# EAGLE design Blitz_Luftdruck_V10 (EAGLE 6.5.0)
Assembly variants: Variante1

## Sheet 1 of 5
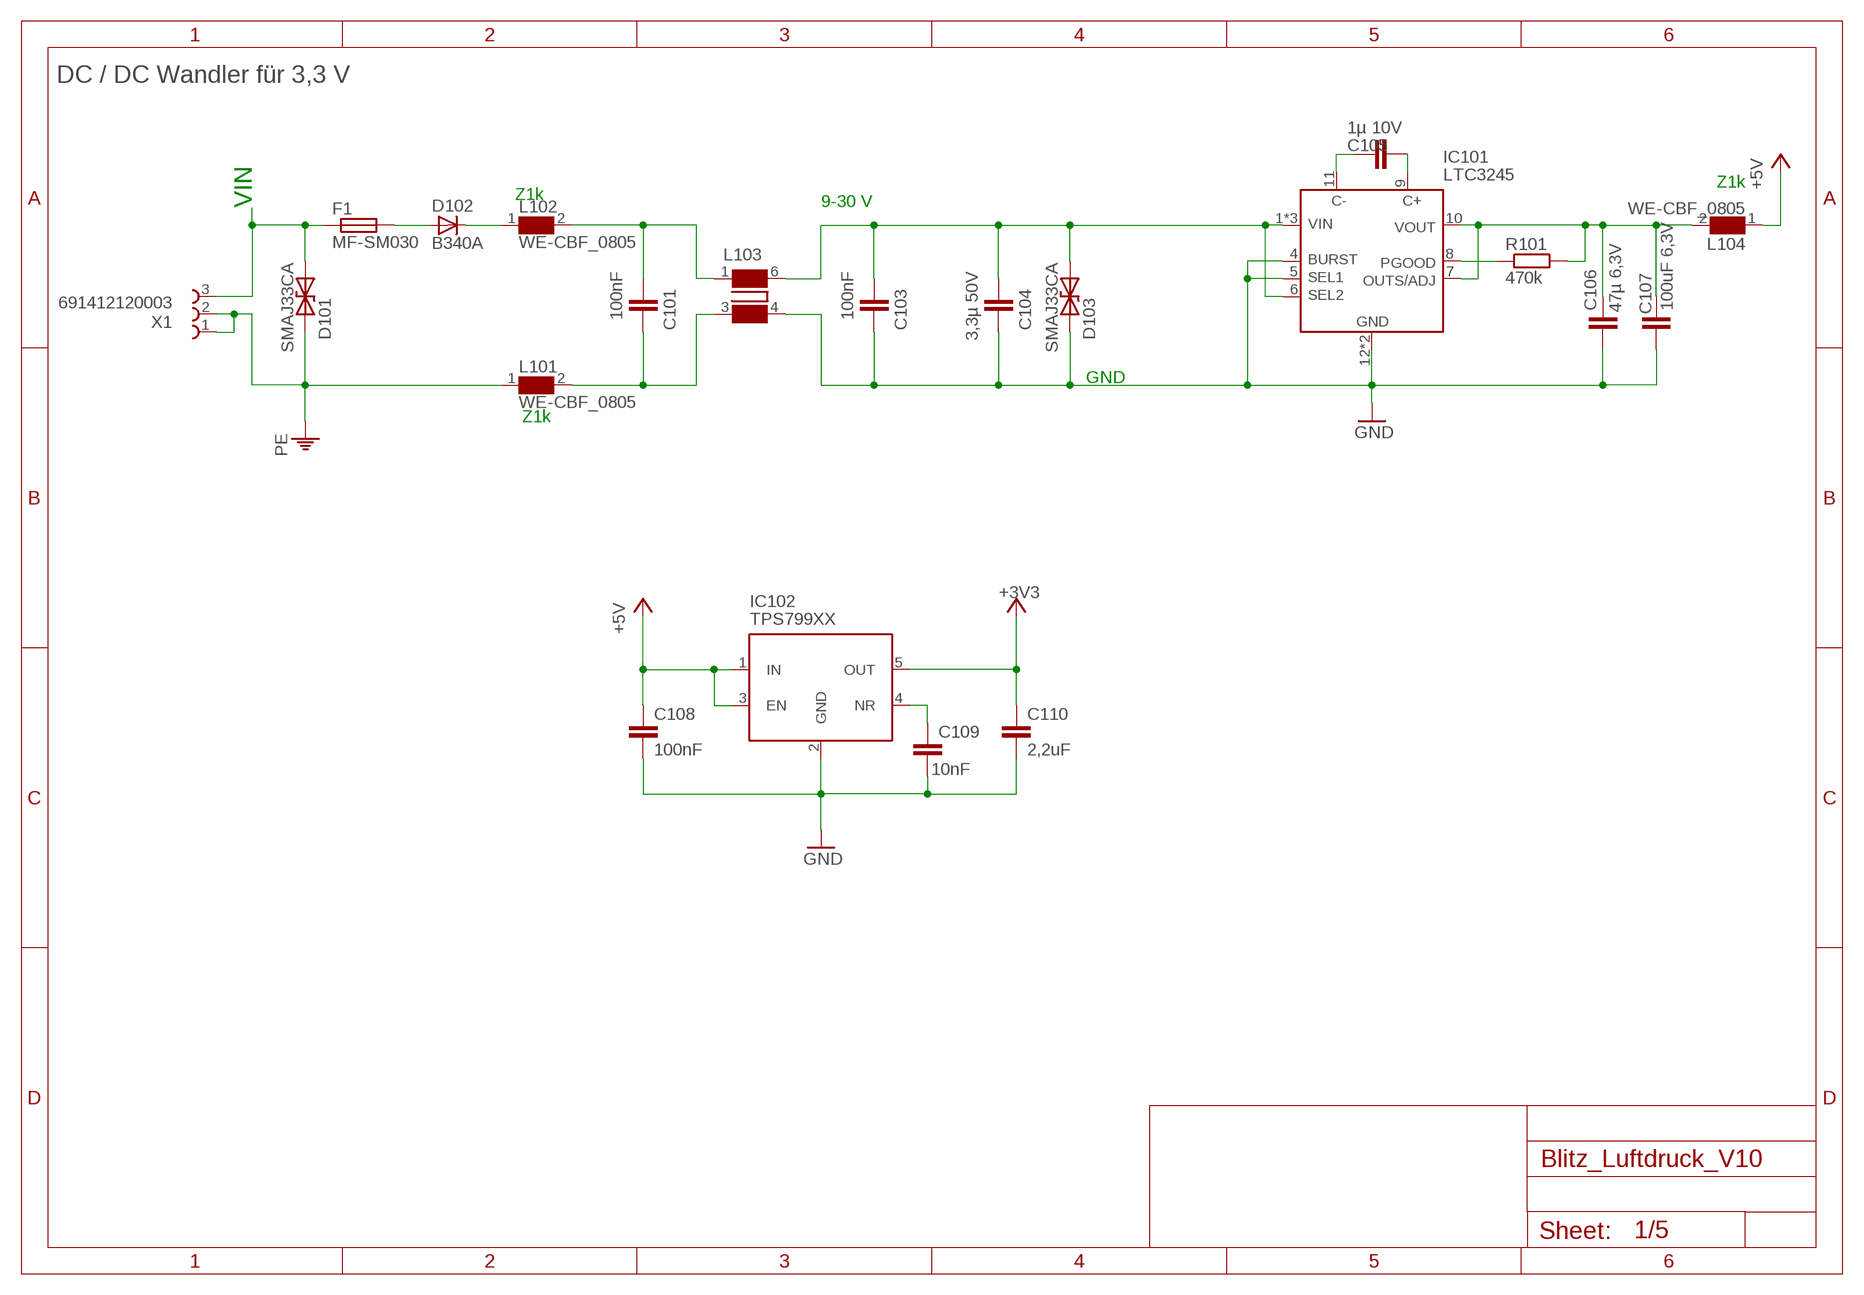
[diagram p0: schematic, sheet 1]

### Parts
C101  100nF  C-EUC0603  [C0603]
C103  100nF  C-EUC0603  [C0603]
C104  3,3µ 50V  C-EUC1210TDK280  [C1210TDK280]
C105  1µ 10V  C-EUC0402MUR55  [C0402MUR55]
C106  47µ 6,3V  C-EUC0805TDK100  [C0805TDK100]
C107  100uF 6,3V  C-EUC1206TDK180  [C1206TDK180]
C108  100nF  C-EUC0603  [C0603]
C109  10nF  C-EUC0402MUR55  [C0402MUR55]
C110  2,2uF  C-EUC0603  [C0603]
D101  SMAJ33CA  [DIOMNP4326X262N]
D102  B340A  [DIOM5226X230N]
D103  SMAJ33CA  [DIOMNP4326X262N]
F1  MF-SM030  [MF-SMX]
IC101  LTC3245  [PSON50P400X300X80-13N]
IC102  TPS799XX  [SOT95P280X110-5N]
L101  WE-CBF_0805  [INDC2012X110N]
L102  WE-CBF_0805  [INDC2012X110N]
L103  WE-SL3_744252...  [WE-SL3_744252...]
L104  WE-CBF_0805  [INDC2012X110N]
R101  470k  R-EU_R0402  [R0402]
X1  691412120003  [691412120003]

### Nets
+3V3: C110.1 IC102.5(OUT) ; also sheet 2,3,5
+5V: C108.1 IC102.1(IN) IC102.3(EN) L104.1 ; also sheet 4
GND: C103.1 C104.1 C106.2 C107.2 C108.2 C109.2 C110.2 D103.1(A) IC101.4(BURST) IC101.5(SEL1) IC101.12(GND) IC101.13(GND) IC102.2(GND) L103.4 ; also sheet 2,3,4,5
LTC3245_VOUT: C106.1 C107.1 IC101.7(ADJ) IC101.10(VOUT) L104.2 R101.2
LTC3245C+: C105.2 IC101.9(C+)
LTC3245C-: C105.1 IC101.11(C-)
LTC3245VIN: C103.2 C104.2 D103.2(C) IC101.1(VIN) IC101.2(VIN) IC101.3(VIN) IC101.6(SEL2) L103.6
N$2: D102.A F1.2
N$3: C101.1 L101.2 L103.3
N$4: C101.2 L102.2 L103.1
N$5: D102.C L102.1
N$10: IC101.8(PGOOD) R101.1
N$40: C109.1 IC102.4(NR)
PE: D101.1(A) L101.1 X1.1 X1.2 ; also sheet 5
VIN: D101.2(C) F1.1 X1.3 ; also sheet 3

### Notes on the sheet
- DC / DC Wandler für 3,3 V
- Z1k
- Z1k
- VIN | 9-30 V
- GND
- Z1k

## Sheet 2 of 5
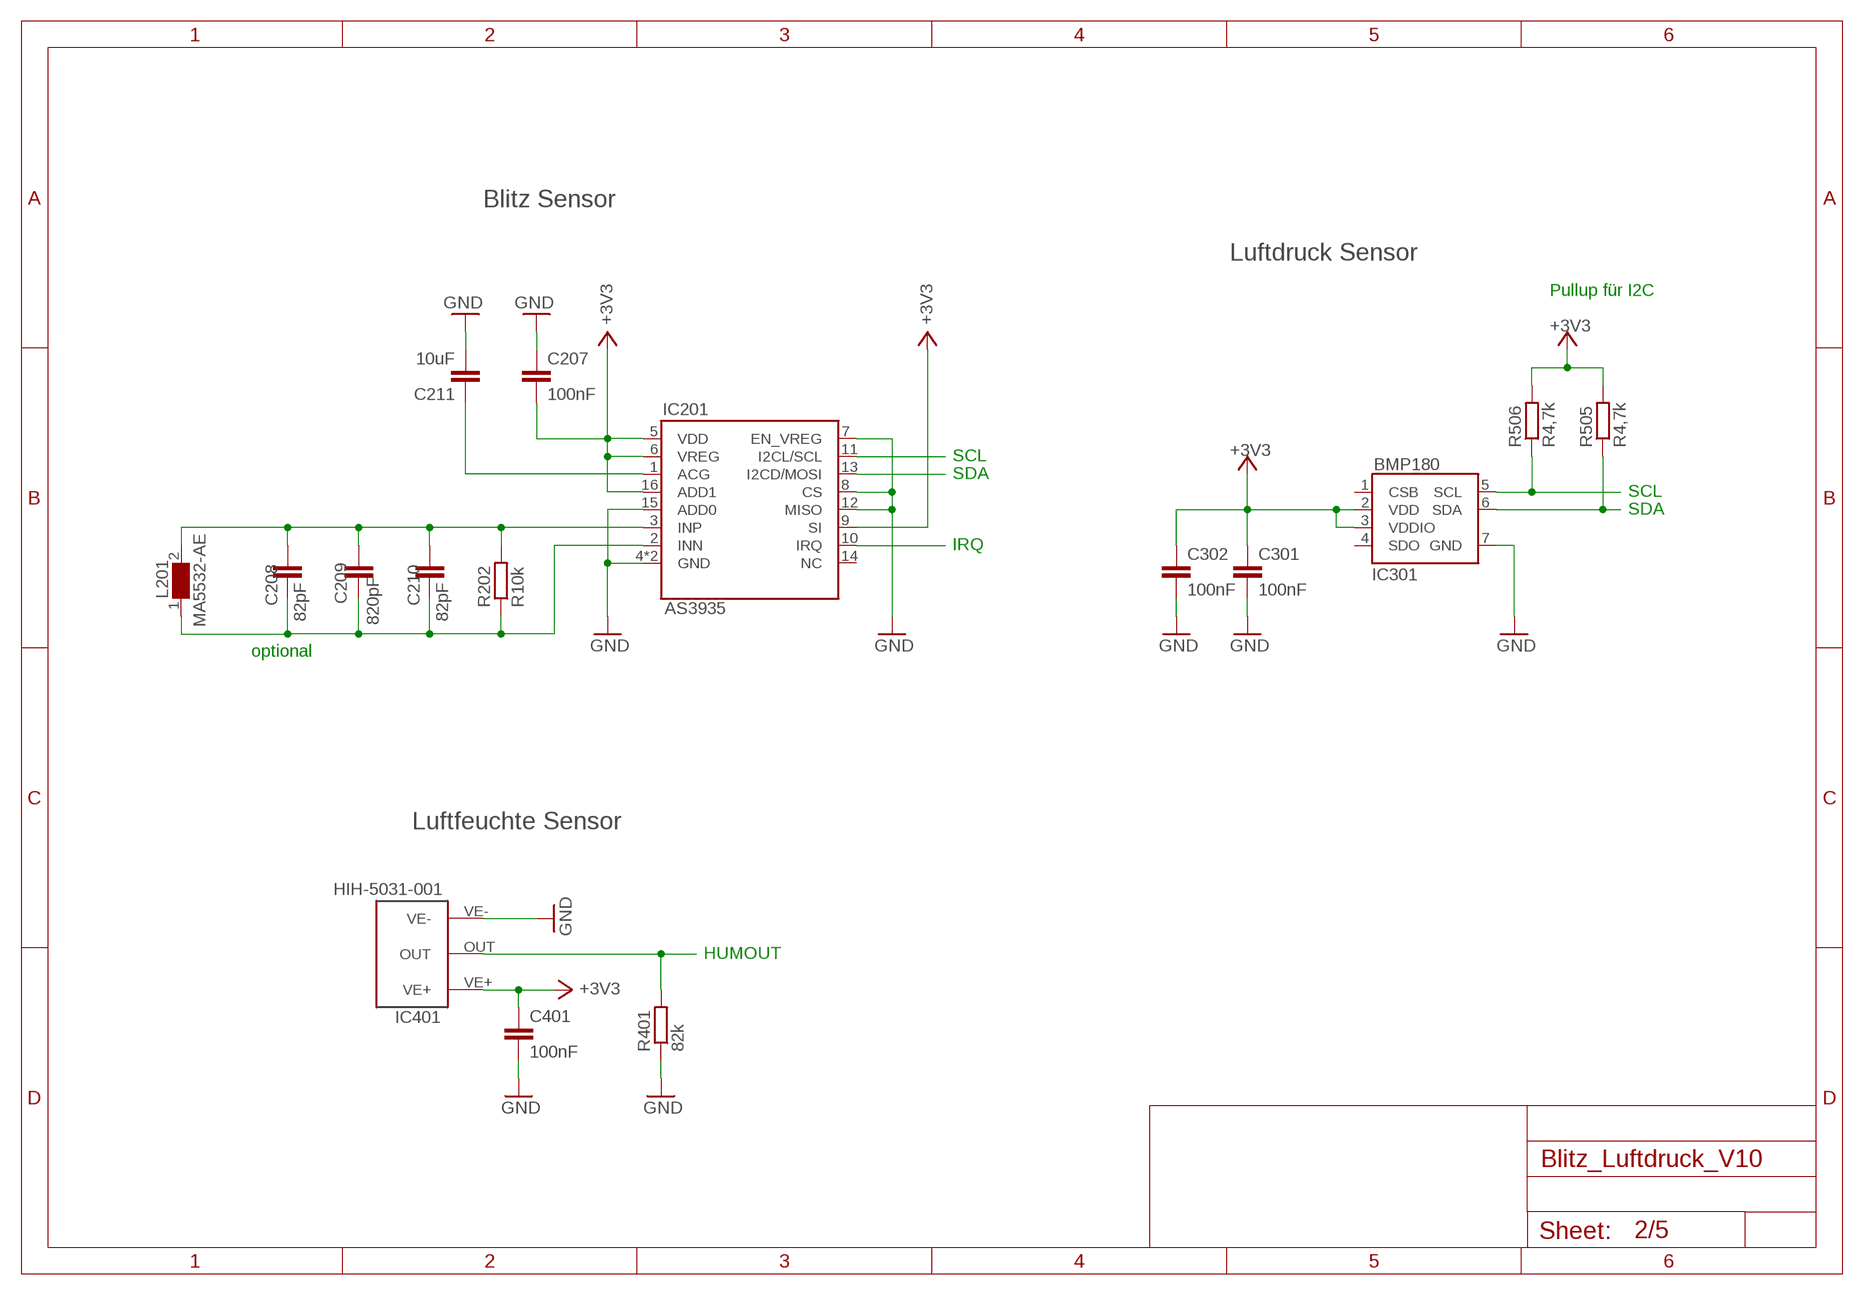
[diagram p1: schematic, sheet 2]

### Parts
C207  100nF  C-EUC0603  [C0603]
C208  82pF  C-EUC0603  [C0603]
C209  820pF  C-EUC0603  [C0603]
C210  82pF  C-EUC0603  [C0603]
C211  10uF  C-EUC0805TDK100  [C0805TDK100]
C301  100nF  C-EUC0603  [C0603]
C302  100nF  C-EUC0603  [C0603]
C401  100nF  C-EUC0603  [C0603]
IC201  AS3935  [QFN65P400X400X80-17N]
IC301  BMP180  [LGA7S150X145P3X3_380X360X100N]
IC401  HIH-5031-001  HIH-4034-004  [HIH-*03*]
L201  MA5532-AE  [MA5532-AE]
R202  R10k  R-EU_R0603VISHTHICK  [R0603VISHTHICK]
R401  82k  R-EU_R0402  [R0402]
R505  R4,7k  R-EU_R0603VISHTHICK  [R0603VISHTHICK]
R506  R4,7k  R-EU_R0603VISHTHICK  [R0603VISHTHICK]

### Nets
+3V3: C207.2 C301.1 C302.1 C401.1 IC201.5(VDD) IC201.6(VREG) IC201.9(SI) IC201.16(ADD1) IC301.2(VDD) IC301.3(VDDIO) IC401.VE+ R505.2 R506.2 ; also sheet 1,3,5
GND: C207.1 C211.2 C301.2 C302.2 C401.2 IC201.4(GND) IC201.7(EN_VREG) IC201.8(CS) IC201.12(MISO) IC201.15(ADD0) IC201.EP(GND) IC301.7(GND) IC401.VE- R401.1 ; also sheet 1,3,4,5
HUMOUT: IC401.OUT R401.2 ; also sheet 3
IRQ: IC201.10(IRQ) ; also sheet 3
N$7: C211.1 IC201.1(ACG)
N$8: C208.1 C209.1 C210.1 IC201.3(INP) L201.2 R202.2
N$9: C208.2 C209.2 C210.2 IC201.2(INN) L201.1 R202.1
SCL: IC201.11(I2CL/SCL) IC301.5(SCL) R506.1 ; also sheet 3
SDA: IC201.13(I2CD/MOSI) IC301.6(SDA) R505.1 ; also sheet 3
Unconnected: IC201.14(NC) IC301.1(CSB)

### Notes on the sheet
- Blitz Sensor
- Luftdruck Sensor
- Pullup für I2C
- SCL
- SDA
- SCL
- SDA
- IRQ
- optional
- Luftfeuchte Sensor
- HUMOUT

## Sheet 3 of 5
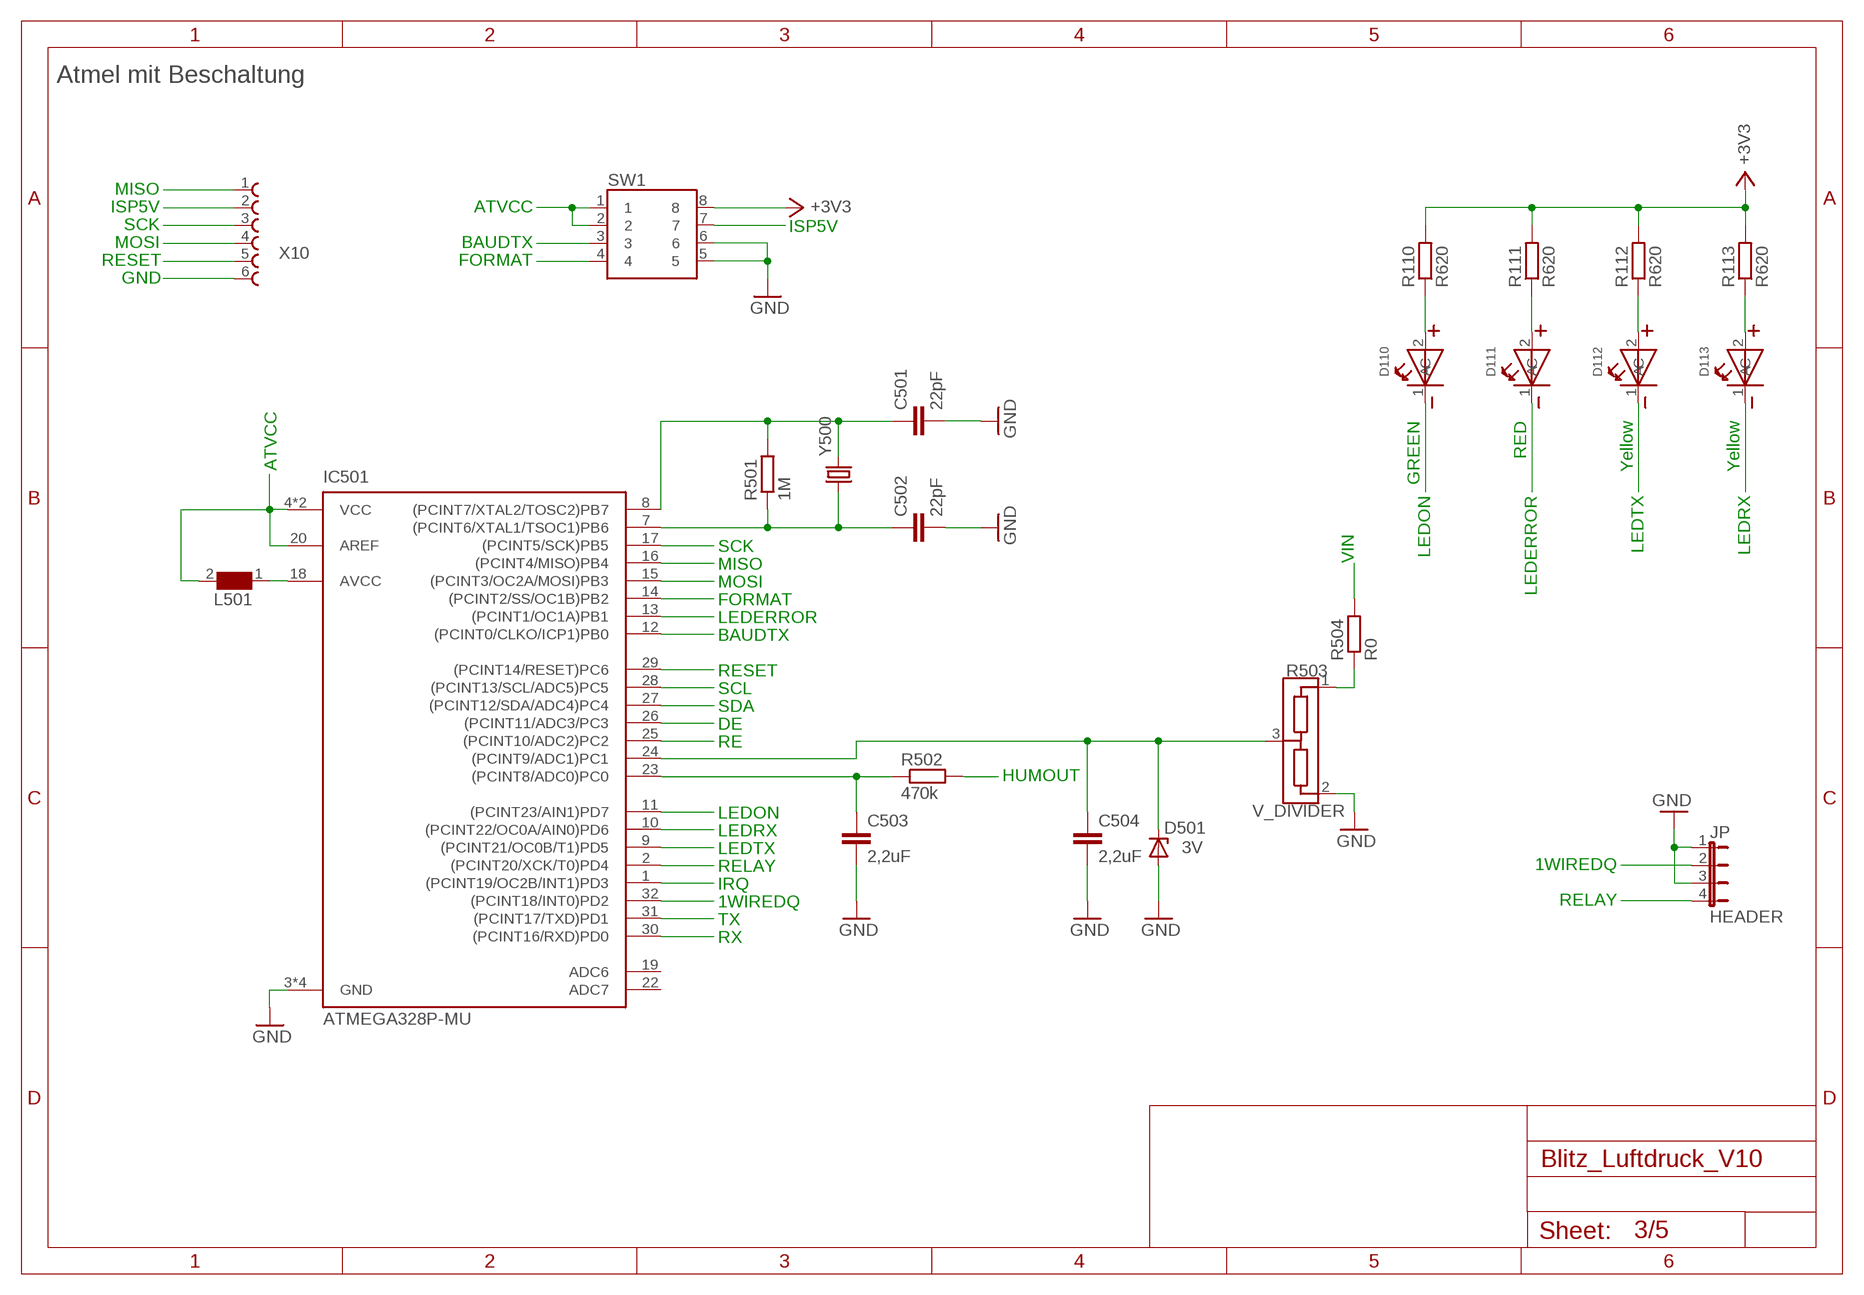
[diagram p2: schematic, sheet 3]

### Parts
C501  22pF  C-EUC0805TDK100  [C0805TDK100]
C502  22pF  C-EUC0805TDK100  [C0805TDK100]
C503  2,2uF  C-EUC0603  [C0603]
C504  2,2uF  C-EUC0603  [C0603]
D110  WL-SMRW156120VS75300-BRIGHTGREEN-RVS-MOUNT  [WL-SMRW-1206-CYLDR-REVERSE-MOUNT]
D111  WL-SMRW156120RS75300-RED-RVS-MOUNT  [WL-SMRW-1206-CYLDR-REVERSE-MOUNT]
D112  WL-SMRW156120YS75300-YELLOW-RVS-MOUNT  [WL-SMRW-1206-CYLDR-REVERSE-MOUNT]
D113  WL-SMRW156120YS75300-YELLOW-RVS-MOUNT  [WL-SMRW-1206-CYLDR-REVERSE-MOUNT]
D501  3V  ZENER-DIODEMMSZ52XX-V  [SODFL3715X135N]
IC501  ATMEGA328P-MU  [QFN50P500X500X100-33N]
JP  HEADER  [SHDRV4W50P254_4X1_1016X254H850P]
L501  WE-CBF_0402  [0402]
R110  R620  R-EU_R0402  [R0402]
R111  R620  R-EU_R0402  [R0402]
R112  R620  R-EU_R0402  [R0402]
R113  R620  R-EU_R0402  [R0402]
R501  1M  R-EU_R0402  [R0402]
R502  470k  R-EU_R0402  [R0402]
R503  V_DIVIDER  [SOT95P229X117-3N]
R504  R0  R-EU_R0603VISHTHICK  [R0603VISHTHICK]
SW1  416131160804  [416131160804]
X10  TC2030-IDC-NL  [TC2030-IDC-NL]
Y500  FOXSDLF/115-20  [XTAL1170X500X450N]

### Nets
1WIREDQ: IC501.32((PCINT18/INT0)PD2) JP.2
+3V3: R110.2 R111.2 R112.2 R113.2 SW1.8 ; also sheet 1,2,5
ADIN24: C504.1 D501.C IC501.24((PCINT9/ADC1)PC1) R503.3
ATVCC: IC501.4(VCC) IC501.6(VCC) IC501.20(AREF) L501.2 SW1.1 SW1.2
BAUDTX: IC501.12((PCINT0/CLKO/ICP1)PB0) SW1.3
DE: IC501.26((PCINT11/ADC3/PC3) ; also sheet 5
FORMAT: IC501.14((PCINT2/SS/OC1B)PB2) SW1.4
GND: C501.2 C502.2 C503.2 C504.2 D501.A IC501.3(GND) IC501.5(GND) IC501.21(GND) IC501.EP(GND) JP.1 JP.3 R503.2 SW1.5 SW1.6 X10.6 ; also sheet 1,2,4,5
HUMIN: C503.1 IC501.23((PCINT8/ADC0)PC0) R502.1
HUMOUT: R502.2 ; also sheet 2
IRQ: IC501.1((PCINT19/OC2B/INT1)PD3) ; also sheet 2
ISP5V: SW1.7 X10.2
LEDERROR: D111.1(C) IC501.13((PCINT1/OC1A)PB1)
LEDON: D110.1(C) IC501.11((PCINT23/AIN1)PD7)
LEDRX: D113.1(C) IC501.10((PCINT22/OC0A/AIN0)PD6)
LEDTX: D112.1(C) IC501.9((PCINT21/OC0B/T1)PD5)
MISO: IC501.16((PCINT4/MISO)PB4) X10.1
MOSI: IC501.15((PCINT3/OC2A/MOSI)PB3) X10.4
N$11: C502.1 IC501.7((PCINT6/XTAL1/TSOC1)PB6) R501.1 Y500.1
N$12: C501.1 IC501.8((PCINT7/XTAL2/TOSC2)PB7) R501.2 Y500.2
N$13: IC501.18(AVCC) L501.1
N$14: D110.2(A) R110.1
N$15: D111.2(A) R111.1
N$16: D112.2(A) R112.1
N$17: D113.2(A) R113.1
N$42: R503.1 R504.1
RE: IC501.25((PCINT10/ADC2)PC2) ; also sheet 5
RELAY: IC501.2((PCINT20/XCK/T0)PD4) JP.4
RESET: IC501.29((PCINT14/RESET)PC6) X10.5
RX: IC501.30((PCINT16/RXD)PD0) ; also sheet 5
SCK: IC501.17((PCINT5/SCK)PB5) X10.3
SCL: IC501.28((PCINT13/SCL/ADC5)PC5) ; also sheet 2
SDA: IC501.27((PCINT12/SDA/ADC4)PC4) ; also sheet 2
TX: IC501.31((PCINT17/TXD)PD1) ; also sheet 5
VIN: R504.2 ; also sheet 1
Unconnected: IC501.19(ADC6) IC501.22(ADC7)

### Notes on the sheet
- Atmel mit Beschaltung
- MISO
- ISP5V | ATVCC
- SCK
- MOSI | BAUDTX | ISP5V
- RESET | FORMAT
- GND
- GREEN | RED | Yellow | Yellow
- ATVCC
- LEDON | LEDERROR | LEDTX | LEDRX
- SCK
- VIN
- MISO
- MOSI
- FORMAT
- LEDERROR
- BAUDTX
- RESET
- SCL
- SDA
- DE
- RE
- HUMOUT
- LEDON
- LEDRX
- LEDTX | 1WIREDQ
- RELAY
- IRQ | RELAY
- 1WIREDQ
- TX
- RX

## Sheet 4 of 5
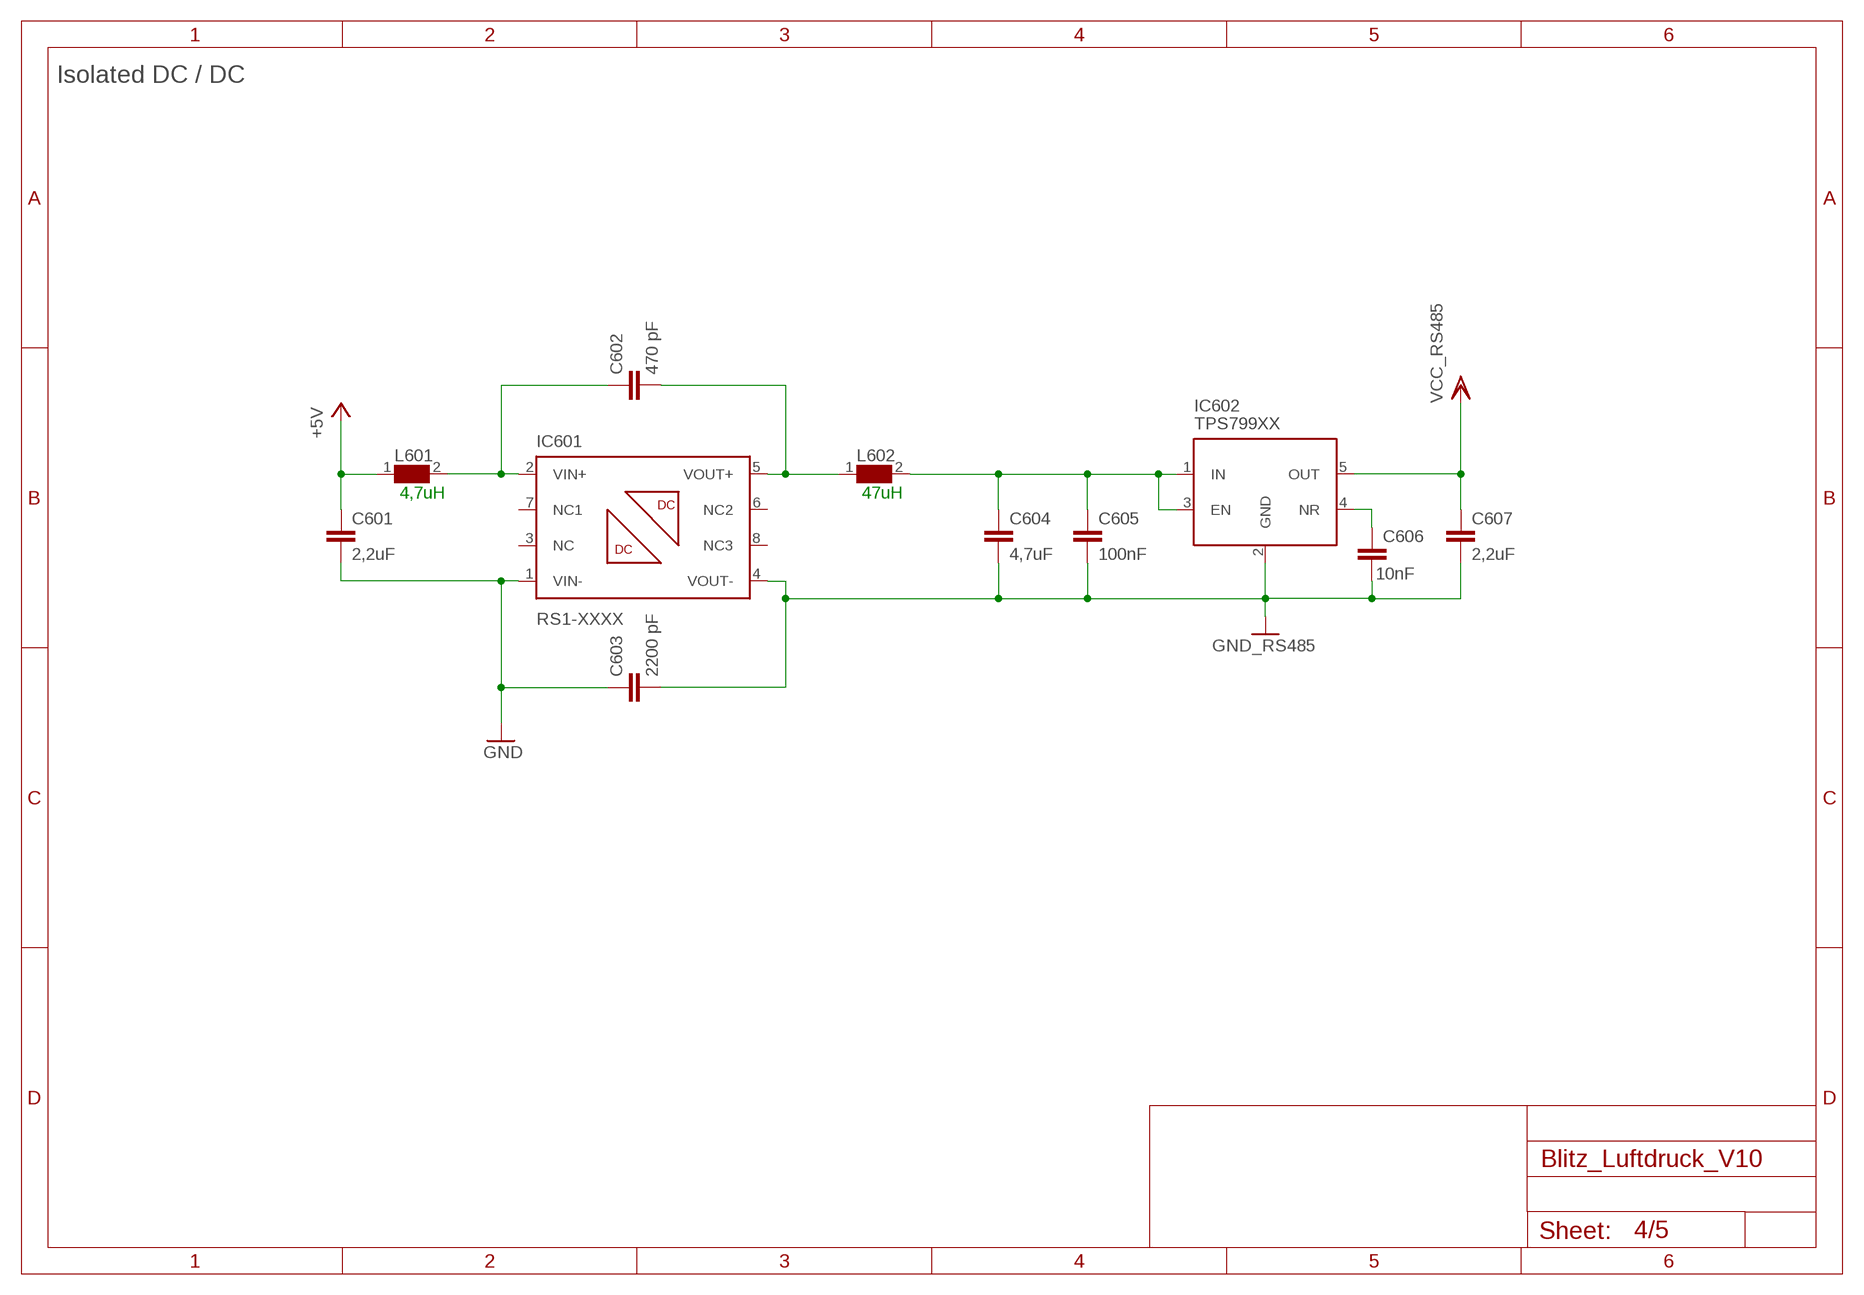
[diagram p3: schematic, sheet 4]

### Parts
C601  2,2uF  C-EUC0805TDK100  [C0805TDK100]
C602  470 pF  C-EUC1812_450X320X140  [CAPC4532X155N]
C603  2200 pF  C-EUC1812_450X320X140  [CAPC4532X155N]
C604  4,7uF  C-EUC0805TDK100  [C0805TDK100]
C605  100nF  C-EUC0603  [C0603]
C606  10nF  C-EUC0402MUR55  [C0402MUR55]
C607  2,2uF  C-EUC0603  [C0603]
IC601  RS1-XXXX  [R1S8-XXXX]
IC602  TPS799XX  [SOT95P280X110-5N]
L601  0806L0806_200X160X160  [INDC2016X180N]
L602  0806L0806_200X160X160  [INDC2016X180N]

### Nets
+5V: C601.1 L601.1 ; also sheet 1
GND: C601.2 C603.1 IC601.1(VIN-) ; also sheet 1,2,3,5
N$18: C606.1 IC602.4(NR)
N$19: C604.1 C605.1 IC602.1(IN) IC602.3(EN) L602.2
N$22: C602.2 IC601.5(VOUT+) L602.1
N$23: C602.1 IC601.2(VIN+) L601.2
RS485_GND: C603.2 C604.2 C605.2 C606.2 C607.2 IC601.4(VOUT-) IC602.2(GND) ; supply symbol labelled GND_RS485 ; also sheet 5
VDD: C607.1 IC602.5(OUT) ; supply symbol labelled VCC_RS485 ; also sheet 5
Unconnected: IC601.3(NC) IC601.6(NC2) IC601.7(NC1) IC601.8(NC3)

### Notes on the sheet
- Isolated DC / DC
- 4,7uH | 47uH

## Sheet 5 of 5
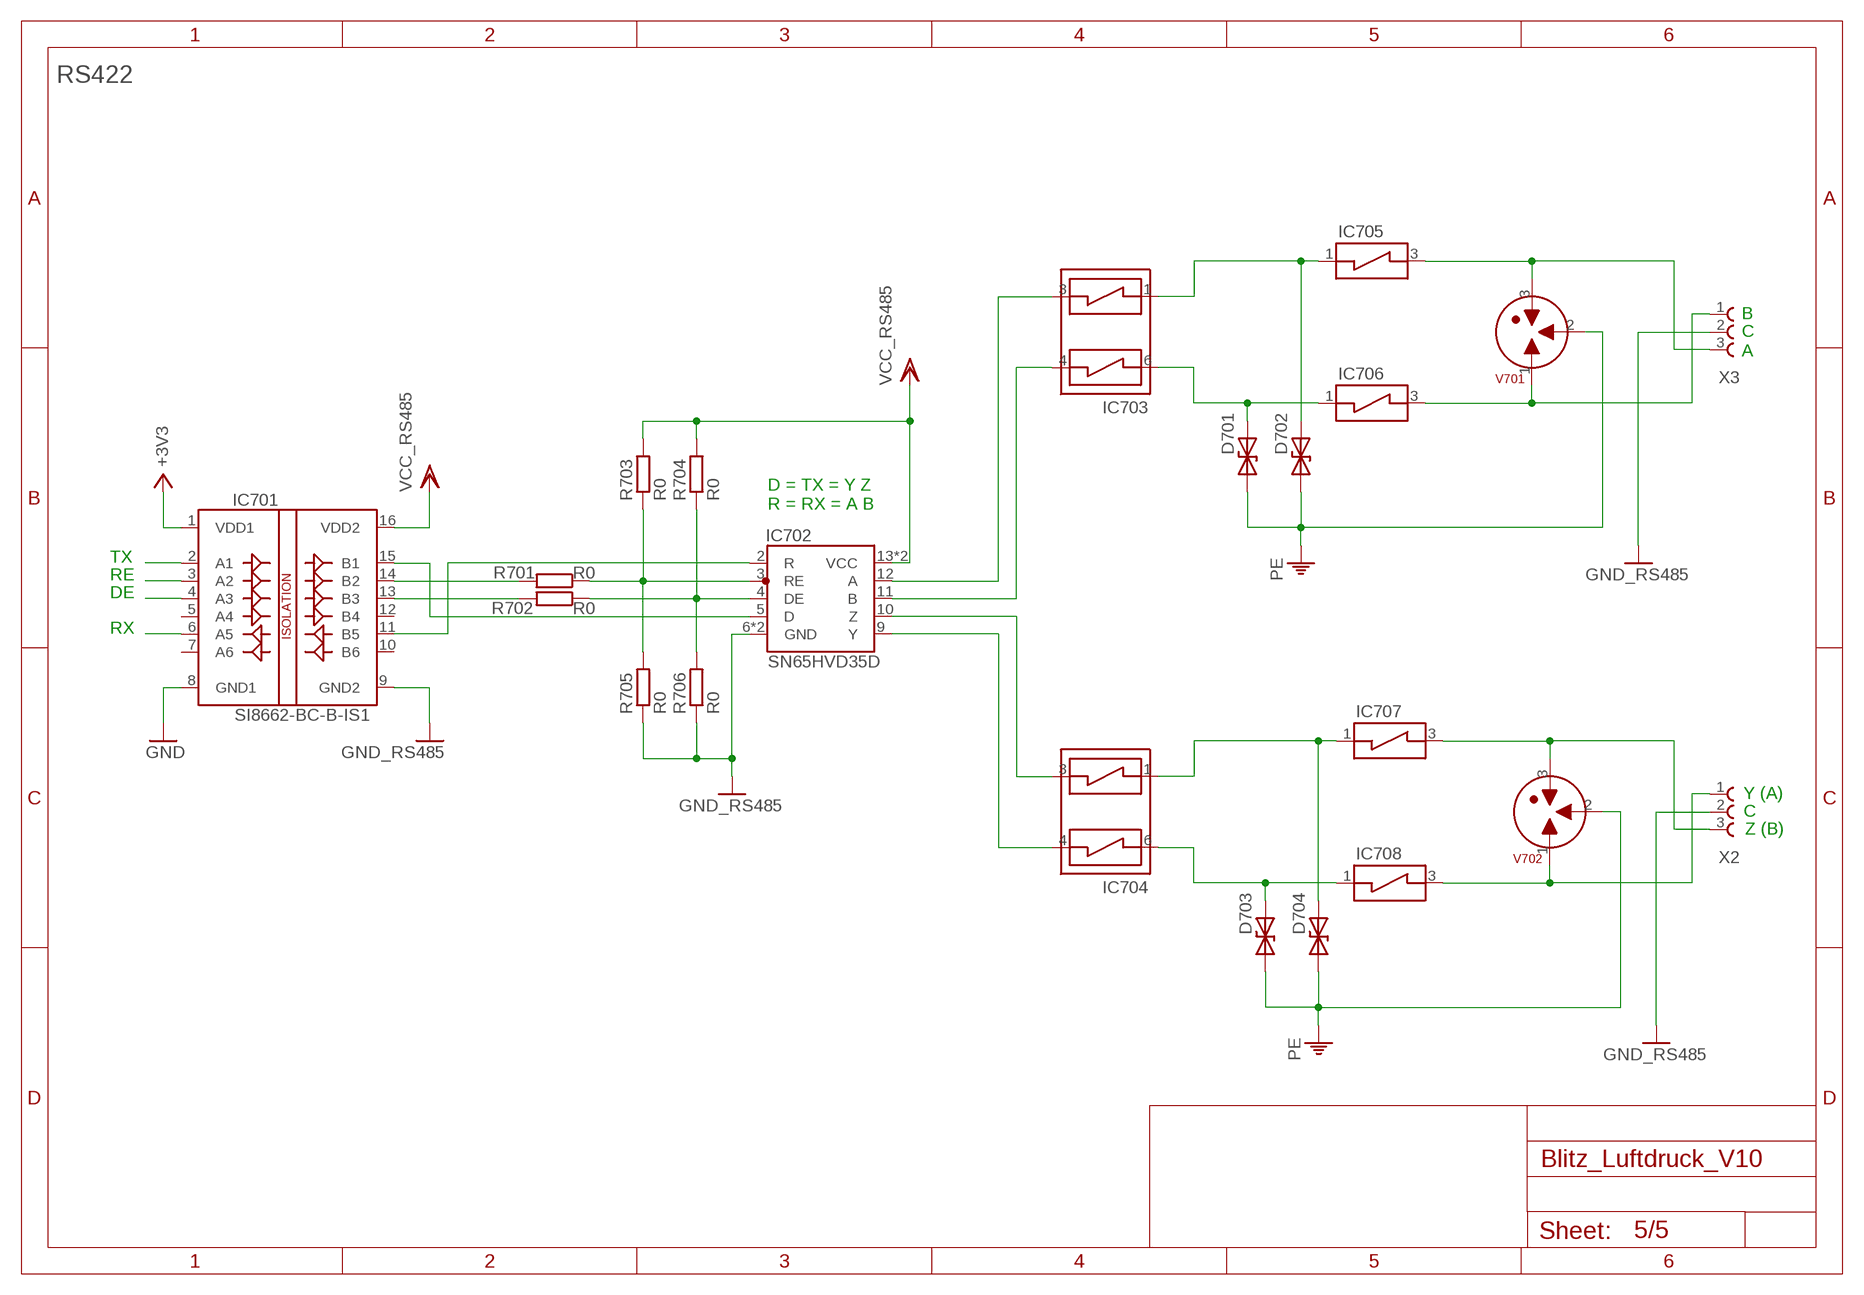
[diagram p4: schematic, sheet 5]

### Parts
D701  SMA6J24CA-TP  [DIOMNP5027X244N]
D702  SMA6J24CA-TP  [DIOMNP5027X244N]
D703  SMA6J24CA-TP  [DIOMNP5027X244N]
D704  SMA6J24CA-TP  [DIOMNP5027X244N]
IC701  SI8662-BC-B-IS1  [SOIC127P600X175-16N]
IC702  SN65HVD35D  [SOIC127P600X175-14N]
IC703  P40-G240-WH  [P40-G240-WH]
IC704  P40-G240-WH  [P40-G240-WH]
IC705  TBU-CA065-200-WH  [TBU-CA]
IC706  TBU-CA065-200-WH  [TBU-CA]
IC707  TBU-CA065-200-WH  [TBU-CA]
IC708  TBU-CA065-200-WH  [TBU-CA]
R701  R0  R-EU_R0603VISHTHICK  [R0603VISHTHICK]
R702  R0  R-EU_R0603VISHTHICK  [R0603VISHTHICK]
R703  R0  R-EU_R0603VISHTHICK  [R0603VISHTHICK]  (not fitted in variant Variante1)
R704  R0  R-EU_R0603VISHTHICK  [R0603VISHTHICK]  (not fitted in variant Variante1)
R705  R0  R-EU_R0603VISHTHICK  [R0603VISHTHICK]  (not fitted in variant Variante1)
R706  R0  R-EU_R0603VISHTHICK  [R0603VISHTHICK]  (not fitted in variant Variante1)
V701  2030-23T-SM-RPLF  [2030-XXT-SM]
V702  2030-23T-SM-RPLF  [2030-XXT-SM]
X2  691412120003  [691412120003]
X3  691412120003  [691412120003]

### Nets
+3V3: IC701.1(VDD1) ; also sheet 1,2,3
DE: IC701.4(A3) ; also sheet 3
GND: IC701.8(GND1) ; also sheet 1,2,3,4
N$6: IC706.3(VIN1) V701.1 X3.1
N$20: IC708.3(VIN1) V702.1 X2.1
N$21: IC702.12(A) IC703.3(OUT1)
N$24: IC707.3(VIN1) V702.3 X2.3
N$25: D704.1(A) IC704.1(IN1) IC707.1(VIN)
N$26: D703.1(A) IC704.6(IN2) IC708.1(VIN)
N$27: IC702.4(DE) R702.1 R704.1 R706.2
N$28: IC705.3(VIN1) V701.3 X3.3
N$29: D702.1(A) IC703.1(IN1) IC705.1(VIN)
N$30: D701.1(A) IC703.6(IN2) IC706.1(VIN)
N$31: IC701.15(B1) IC702.5(D)
N$32: IC702.9(Y) IC704.4(OUT2)
N$33: IC701.11(B5) IC702.2(R)
N$34: IC702.11(B) IC703.4(OUT2)
N$35: IC702.10(Z) IC704.3(OUT1)
N$36: IC702.3(RE) R701.1 R703.1 R705.2
N$37: IC701.13(B3) R702.2
N$38: IC701.14(B2) R701.2
PE: D701.2(C) D702.2(C) D703.2(C) D704.2(C) V701.2 V702.2 ; also sheet 1
RE: IC701.3(A2) ; also sheet 3
RS485_GND: IC701.9(GND2) IC702.6(GND) IC702.7(GND) R705.1 R706.1 X2.2 X3.2 ; supply symbol labelled GND_RS485 ; also sheet 4
RX: IC701.6(A5) ; also sheet 3
TX: IC701.2(A1) ; also sheet 3
VDD: IC701.16(VDD2) IC702.13(VCC) IC702.14(VCC) R703.2 R704.2 ; supply symbol labelled VCC_RS485 ; also sheet 4
Unconnected: IC701.5(A4) IC701.7(A6) IC701.10(B6) IC701.12(B4)

### Notes on the sheet
- RS422
- B
- C
- A
- D = TX = Y Z
  R = RX = A B
- TX
- RE
- DE
- RX
- Y (A)
- C
- Z (B)

## Power pins joined to a net without a drawn wire
SDO: IC301.4(SDO)

## Library data of the parts
C101 C103 C108 C207 C301 C302 C401 C605 = EN_Kondensator:C-EU: CAPACITOR, European symbol; EPN: 01002290096
C104 = EN_Kondensator:C-EU: CAPACITOR, European symbol; EPN: 01002860132
C105 = EN_Kondensator:C-EU: CAPACITOR, European symbol; EPN: 01002870133
C106 = EN_Kondensator:C-EU: CAPACITOR, European symbol; EPN: 01002890135
C107 = EN_Kondensator:C-EU: CAPACITOR, European symbol; EPN: 01002880134
C109 C606 = resistor:C-EU: CAPACITOR, European symbol; EPN: 01002510077
C110 C503 C504 C601 C607 = resistor:C-EU: CAPACITOR, European symbol; EPN: 01002610095
C208 C210 = EN_Kondensator:C-EU: CAPACITOR, European symbol; EPN: 01003480271
C209 = EN_Kondensator:C-EU: CAPACITOR, European symbol; EPN: 01003490270
C211 = resistor:C-EU: CAPACITOR, European symbol; EPN: 01002440067
C501 C502 = resistor:C-EU: CAPACITOR, European symbol; EPN: 01003070156
C602 = EN_Kondensator:C-EU: CAPACITOR, European symbol; EPN: 01003570240
C603 = EN_Kondensator:C-EU: CAPACITOR, European symbol; EPN: 01003560239
C604 = resistor:C-EU: CAPACITOR, European symbol; EPN: 01002170031
D101 D103 = EN_Diode:SMAJ: Bourns Suppressor Diode SMAJ Serie Landing pattern DIOMNP4326X262N / PCB Library Expert 2013.12 (c) 2014 Modified by Michael Simbuerger, Elaborated Networks GmbH; EPN: 01003110160
D102 = EN_Diode:B340A: Diodes Incorporated Diode B340A EPN: 01003100159 Landing pattern DIOM5226X230N / PCB Library Expert 2013.12 (c) 2014 Modified by Michael Simbuerger, Elaborated Networks GmbH; EPN: 01003100159
D110 = Wuerth_Elektronik_LEDs_V6_E63:WL-SMRW: WL-SMRW SMD mono-color reverse mount waterclear Characteristics: • small size & thin body for space saving • ideal for narrow space applications • wide viewing angle • low energy consumption • industry standard footprint • small package for exceptional brightness • to emit light through a small cuo-out hole in PCB • compatible with automatic placement machine Applications: • Backlight for automobile DVD • Indoor displays • Optical indicators • General lighting • Toys; COMPANY-URL: http://www.we-online.de; CREATED-BY: Christin Otto; CREATED-DATE: APR 2013; DATASHEET-URL: http://katalog.we-online.de/en/led/WL-SMRW?m=t&sq=smrw&sp=&sp=http%3A%2F%2Fwww.we-online.de%2Fweb%2Fen%2Felectronic_components%2Fsearchpage_PBS.php%3Fsearch%3Dsmrw#vs_ct:1;; EPN: 01003400236; MANUFACTURER: Würth Elektronik eiSos GmbH
D111 = Wuerth_Elektronik_LEDs_V6_E63:WL-SMRW: WL-SMRW SMD mono-color reverse mount waterclear Characteristics: • small size & thin body for space saving • ideal for narrow space applications • wide viewing angle • low energy consumption • industry standard footprint • small package for exceptional brightness • to emit light through a small cuo-out hole in PCB • compatible with automatic placement machine Applications: • Backlight for automobile DVD • Indoor displays • Optical indicators • General lighting • Toys; COMPANY-URL: http://www.we-online.de; CREATED-BY: Christin Otto; CREATED-DATE: APR 2013; DATASHEET-URL: http://katalog.we-online.de/en/led/WL-SMRW?m=t&sq=smrw&sp=&sp=http%3A%2F%2Fwww.we-online.de%2Fweb%2Fen%2Felectronic_components%2Fsearchpage_PBS.php%3Fsearch%3Dsmrw#vs_ct:1;; EPN: 01003390230; MANUFACTURER: Würth Elektronik eiSos GmbH
D112 D113 = Wuerth_Elektronik_LEDs_V6_E63:WL-SMRW: WL-SMRW SMD mono-color reverse mount waterclear Characteristics: • small size & thin body for space saving • ideal for narrow space applications • wide viewing angle • low energy consumption • industry standard footprint • small package for exceptional brightness • to emit light through a small cuo-out hole in PCB • compatible with automatic placement machine Applications: • Backlight for automobile DVD • Indoor displays • Optical indicators • General lighting • Toys; COMPANY-URL: http://www.we-online.de; CREATED-BY: Christin Otto; CREATED-DATE: APR 2013; DATASHEET-URL: http://katalog.we-online.de/en/led/WL-SMRW?m=t&sq=smrw&sp=&sp=http%3A%2F%2Fwww.we-online.de%2Fweb%2Fen%2Felectronic_components%2Fsearchpage_PBS.php%3Fsearch%3Dsmrw#vs_ct:1;; EPN: 01003540237; MANUFACTURER: Würth Elektronik eiSos GmbH
D501 = EN_Diode:ZENER-DIODE: Z-Diode; EPN: 01003750268
D701-D704 = EN_Diode:SMA6J: MCC Suppressor Diode SMA6J5.0 THRU SMA6J33A Serie Bipolare Version Landing pattern DIOMNP5027X244N / PCB Library Expert 2013.12 (c) 2014 Modified by Michael Simbuerger, Elaborated Networks GmbH; EPN: 01003650247
F1 = EN_Widerstand:MF-SM: Bourns PTC MF-SM Serie Michael Simbürger; EPN: 01003120229
IC101 = EN_IC:LTC3245; EPN: 01002900137
IC102 IC602 = EN_IC:TPS799XX: TPS799xx Low Dropout Linear Regulator Landing pattern SOT95P280X110-5N / PCB Library Expert 2013.12 EPN: 01003550238 (c) 2014 Modified by Michael Simbuerger, Elaborated Networks GmbH; EPN: 01003550238
IC201 = EN_IC:AS3935: Franklin Ligtning Sensor AS3935 AustriaMicroSystems EPN: 01003470223 Landing pattern QFN65P400X400X80-17N / PCB Library Expert 2013.12 (c) 2014 Modified by Michael Simbuerger, Elaborated Networks GmbH; EPN: 01003470223
IC301 = EN_IC:BMP180: Bosch BMP180 Digital pressure sensor - I2C Interface (c) 2014 Modified by Michael Simbuerger, Elaborated Networks GmbH; EPN: 01003500227
IC401 = Honeywell_HIH_Humidity:HIH-*03*-00*: Humidity Sensors from Honeywell Packages: SMD: HIH-4030-001 (5 V) HIH-4030-003 (5 V, calibrated, data printout) HIH-4031-001 (5 V, hydrophobic filtered) HIH-4031-003 (5 V, hydrophobic filtered, calibrated, data printout) HIH-5030-001 (2,7 V) HIH-5031-001 (2,7 V, hydrophobic filtered) 4 Pads, 3 connected to VDC, GND, Out (c) 2009 Stefan Werner, Elaborated Networks GmbH; EPN: 01003530234; HEIGHT: 3 mm; VOLT: 5 V
IC501 = EN_IC:ATMEGA: ATmega Serie Landing pattern QFN50P500X500X100-33N / PCB Library Expert 2013.12 (c) 2014 Modified by Michael Simbuerger, Elaborated Networks GmbH; EPN: 01003510228
IC601 = EN_IC:RS1-XXXX: RECOM DC/DC Wandler Isolated R1S8-3.33.3 3.3 Vin, 3,3 Vout (c) 2014 Modified by Michael Simbuerger, Elaborated Networks GmbH; EPN: 01003580278
IC701 = EN_IC:SI866: Low Power Six Channel Digital Isolator Si866x Serie Silicon Valley (c) 2014 Modified by Michael Simbuerger, Elaborated Networks GmbH; DEFAULT_OUT: LOW; EPN: 01003720266; ISOLATION: 3.75; MBPS: 150; VDD1_IN: 4; VDD2_IN: 2
IC702 = EN_IC:SN65HVD35D: SN65HVD35D 3.3 V RS-485 Driver Texas Instruments (c) 2014 Modified by Michael Simbuerger, Elaborated Networks GmbH; EPN: 01003680252
IC703 IC704 = EN_IC:P40-G: BOURNS TBU High Speed Protector Model: P40-G240-WH (c) 2014 Modified by Michael Simbuerger, Elaborated Networks GmbH; EPN: 01003660248
IC705-IC708 = EN_IC:TBU-CA: Bourns TBU Device TBU-CA Serie (c) 2014 Modified by Michael Simbuerger, Elaborated Networks GmbH; EPN: 01003630246
JP = EN_Konnektor:HEADER
L101 L102 L104 = EN_Induktivität:WE-CBF: SMD EMI Suppression Ferrite Beads WE-CBF - Excellent anti-EMI properties - Low DC-restistance - Impedances till 3000 ohms - Rated current up to 6 A -- Reliable Ni-Sn electrodes -- Perfect as data lined filter and for uncoupling of distribution voltage; EPN: 01002130136
L103 = EN_Induktivität:WE-SL3_744252...: SMD Common Mode Line Filter WE-SL3 - Small size - Low Profile, only 2.5 mm - High Impedance tp to 5000 ohm - High Current up to 700mA - Low leakage inductance - USB - CAN - Firewire - Data Lines - Power Lines; EPN: 01002110024
L201 = EN_Induktivität:MA5532-AE: RFID Antenne MA5532-AE Coilcraft EPN: 01003460222 (c) 2014 Modified by Michael Simbuerger, Elaborated Networks GmbH; EPN: 01003460222
L501 = EN_Induktivität:WE-CBF: SMD EMI Suppression Ferrite Beads WE-CBF - Excellent anti-EMI properties - Low DC-restistance - Impedances till 3000 ohms - Rated current up to 6 A -- Reliable Ni-Sn electrodes -- Perfect as data lined filter and for uncoupling of distribution voltage; EPN: 01002120025
L601 = EN_Induktivität:0806; EPN: 01003780275
L602 = EN_Induktivität:0806; EPN: 01003790276
R101 = EN_Widerstand:R-EU_: RESISTOR, European symbol; EPN: 01000600014
R110-R113 = EN_Widerstand:R-EU_: RESISTOR, European symbol; EPN: 01001880274
R202 = EN_Widerstand:R-EU_: RESISTOR, European symbol; EPN: 01000400184
R401 = resistor:R-EU_: RESISTOR, European symbol; EPN: 01000510101
R501 = resistor:R-EU_: RESISTOR, European symbol; EPN: 01000640235
R502 = resistor:R-EU_: RESISTOR, European symbol; EPN: 01000600014
R503 = EN_Widerstand:V_DIVIDER: Spannungsteiler (c) 2014 Modified by Michael Simbuerger, Elaborated Networks GmbH; EPN: 01003740267; HERSTELLER: Maxim
R504 R701-R706 = EN_Widerstand:R-EU_: RESISTOR, European symbol; EPN: 01001800180
R505 R506 = EN_Widerstand:R-EU_: RESISTOR, European symbol; EPN: 01000360185
SW1 = EN_Konnektor:416131160804: WS-HP-1.27 mm small compact SMD Dip Switch with top tape,8 pins,4 poles; EPN: 01003690258
V701 V702 = EN_Varistoren:2030-23T-SM-RPLF: Bourns 3-Electrode Miniature Gas Discharge Tube 2030-xxT-SM Serie (c) 2014 Modified by Michael Simbuerger, Elaborated Networks GmbH; EPN: 01003620245
X1-X3 = Wuerth_Elektronik_eiCan_14_Terminal_Blocks_WR-TBL_2_0_E4x:691412120003: WR-TBL Serie 412 - 3.5mm Screwless 45° Entry Grey - 1.5mm2 Wires, 3 Pins; EPN: 01003770272
X10 = EN_Konnektor:TC2030-IDC-NL: 6-Pin TAG CONNECT Verbinder Ohne Haltebeine (c) 2014 Modified by Michael Simbuerger, Elaborated Networks GmbH
Y500 = EN_IC:FOXSDLF: FOX SMD Quarz Model: HC49SDLF Landing pattern XTAL1170X500X450N / PCB Library Expert 2013.12 (c) 2014 Modified by Michael Simbuerger, Elaborated Networks GmbH; EPN: 01003290181; FREQUENZ: 11.059200

## Net classes
0 default: width 0.254 mm

## Board
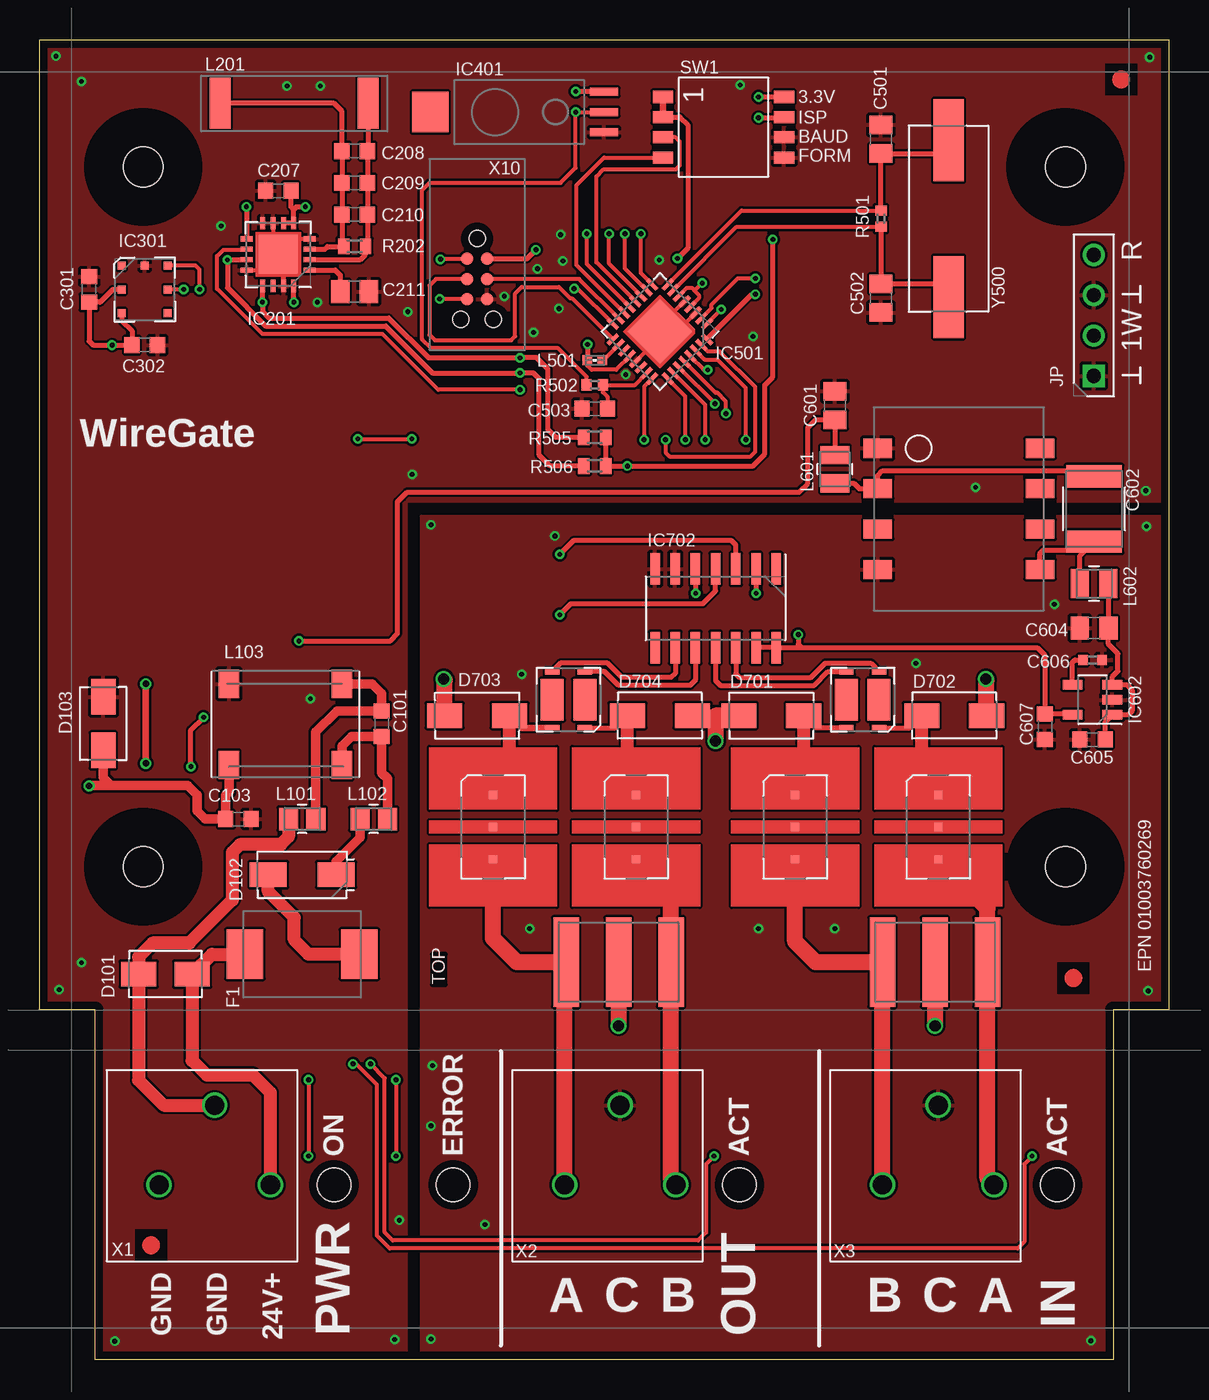
[diagram p5: board, top side]
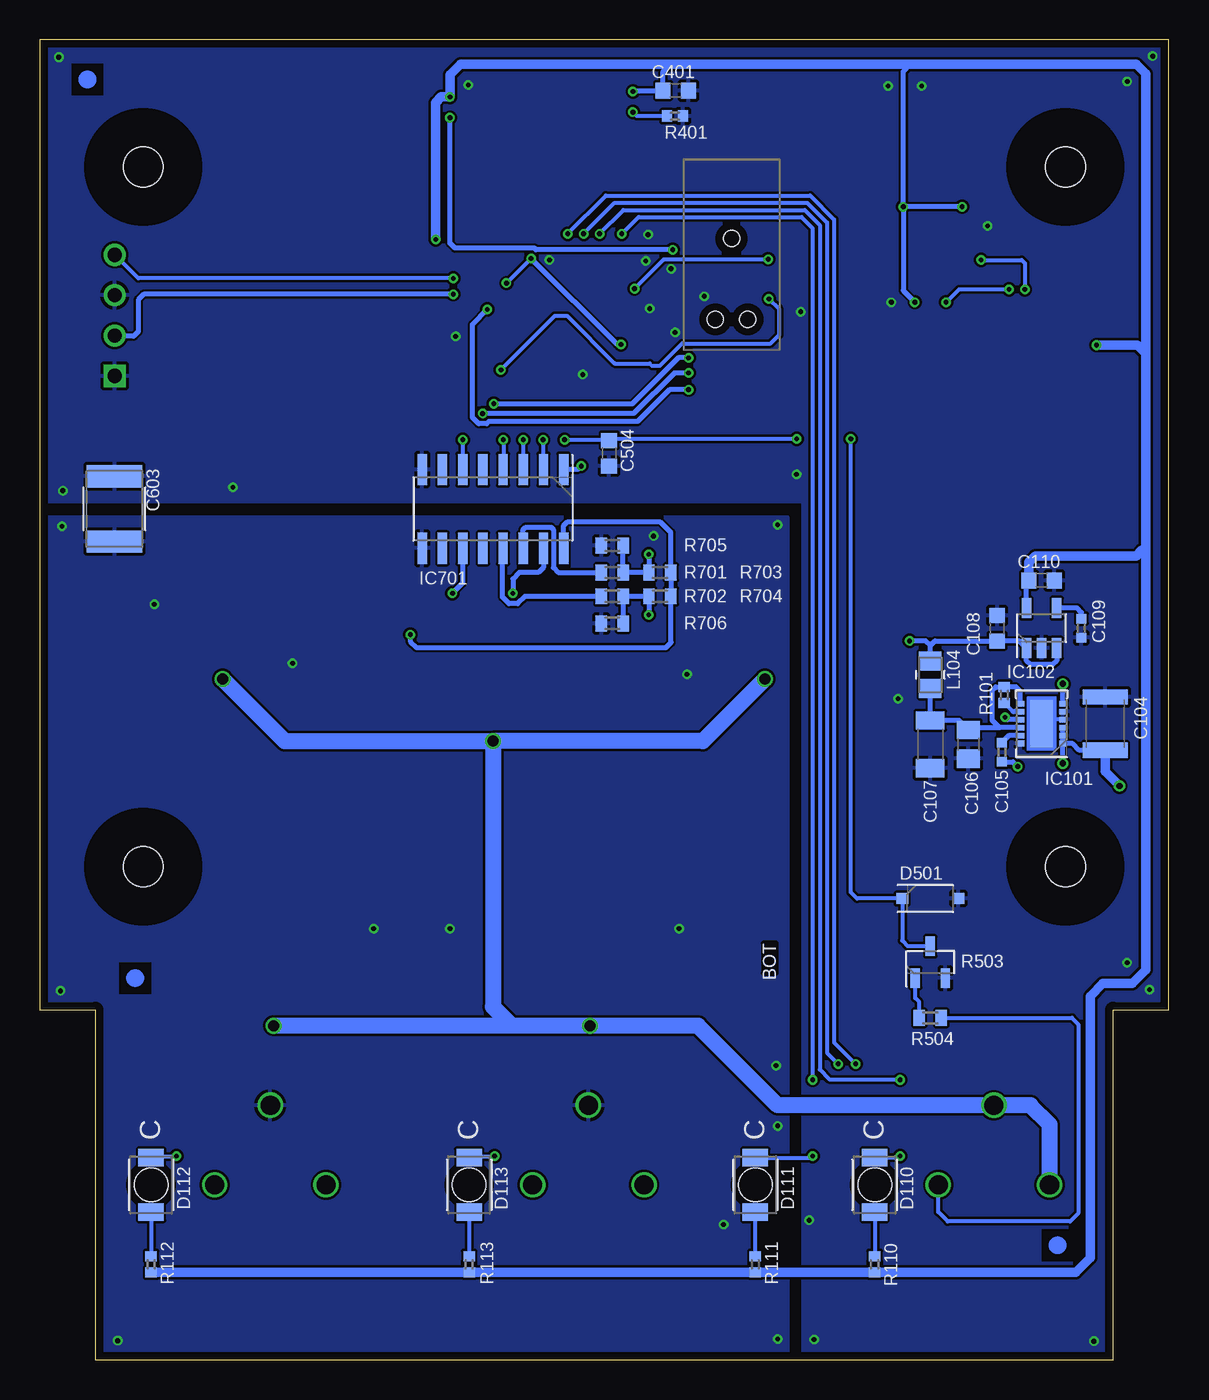
[diagram p6: board, bottom side, seen from below]

Size 71 x 83 mm. Coordinates in mm from the lower left corner, seen from the top.
Outline: 71,22 67.5,22 67.5,0 3.5,0 3.5,22 0,22 0,83 71,83 71,22
Copper layers (1*16): Top 0.035mm / dielectric 1.5mm / Bottom 0.035mm
Design rules "2011-08-18_Multi-PCB_SPAR_150": minimum track width 0.15mm, minimum drill 0.3mm, track to track 0.15mm, track to pad 0.15mm, pad to pad 0.15mm, via to via 0.15mm, smd to smd 0.15mm, copper to edge 0.5mm, drill to drill 8mil, minimum pad ring 0.2mm, minimum via ring 0.15mm, stop-mask expansion 0.05mm, vias tented up to drill 10mil, thermal gap 8mil
Holes 2.5 mm at 6.5,75 64.5,75 64.5,31 6.5,31
tRestrict: area 3,71.5 to 10,78.5; area 61,71.5 to 68,78.5; area 3,27.5 to 10,34.5; area 61,27.5 to 68,34.5
bRestrict: area 3,71.5 to 10,78.5; area 3,27.5 to 10,34.5; area 61,27.5 to 68,34.5; area 61,71.5 to 68,78.5

### Footprints (pad centres in the part's own frame; a part is rotated, then mirrored left to right if it is on the bottom)
C0603 = smd 0.95 x 1: 1 -0.8,0; 2 0.8,0
C1210TDK280 = smd 0.96 x 2.81: 1 -1.675,0; 2 1.675,0
C0402MUR55 = smd 0.6 x 0.62: 1 -0.6,0; 2 0.6,0
C0805TDK100 = smd 1.15 x 1.45: 1 -0.9,0; 2 0.9,0
C1206TDK180 = smd 1.15 x 1.8: 1 -1.5,0; 2 1.5,0
CAPC4532X155N = smd 1.4 x 3.51: 1 -2.055,0; 2 2.055,0
DIOMNP4326X262N = smd 2.22 x 1.55: 1 -1.68,0; 2 1.68,0
DIOM5226X230N = smd 2.33 x 1.55: A 2.135,0; C -2.135,0
WL-SMRW-1206-CYLDR-REVERSE-MOUNT = smd 1.1 x 1.6: 1 -1.7,0; 2 1.7,0 | hole 2.1: 0,0
SODFL3715X135N = smd 0.75 x 0.68: A 1.76,0; C -1.76,0
DIOMNP5027X244N = smd 2.21 x 1.55: 1 -2.04,0; 2 2.04,0
MF-SMX = smd 2.3 x 3.1: 1 -3.6,0; 2 3.6,0
PSON50P400X300X80-13N = smd 0.35 x 0.46: 1 -1.25,-1.33; 2 -0.75,-1.33; 3 -0.25,-1.33; 4 0.25,-1.33; 5 0.75,-1.33; 6 1.25,-1.33; 7 1.25,1.33; 8 0.75,1.33; 9 0.25,1.33; 10 -0.25,1.33; 11 -0.75,1.33; 12 -1.25,1.33 | smd 3 x 1.4: 13 0,0
SOT95P280X110-5N = smd 0.59 x 1.25: 1 -0.95,-1.255; 2 0,-1.255; 3 0.95,-1.255; 4 0.95,1.255; 5 -0.95,1.255
QFN65P400X400X80-17N = smd 0.32 x 0.76: 1 -0.975,-1.98; 2 -0.325,-1.98; 3 0.325,-1.98; 4 0.975,-1.98; 9 0.975,1.98; 10 0.325,1.98; 11 -0.325,1.98; 12 -0.975,1.98 | smd 0.76 x 0.32: 5 1.98,-0.975; 6 1.98,-0.325; 7 1.98,0.325; 8 1.98,0.975; 13 -1.98,0.975; 14 -1.98,0.325; 15 -1.98,-0.325; 16 -1.98,-0.975 | smd 2.4 x 2.4: EP 0,0
LGA7S150X145P3X3_380X360X100N = smd 0.5 x 0.5: 1 -1.5,-1.45; 2 0,-1.45; 3 1.5,-1.45; 4 1.5,1.45; 5 0,1.45; 6 -1.5,1.45; 7 -1.5,0
HIH-*03* = smd 2.286 x 2.54: HOLD -5.588,0 | smd 1.778 x 0.508: OUT 5.334,0; VE+ 5.334,1.27; VE- 5.334,-1.27
QFN50P500X500X100-33N = smd 0.26 x 0.86: 1 -1.75,-2.435; 2 -1.25,-2.435; 3 -0.75,-2.435; 4 -0.25,-2.435; 5 0.25,-2.435; 6 0.75,-2.435; 7 1.25,-2.435; 8 1.75,-2.435; 17 1.75,2.435; 18 1.25,2.435; 19 0.75,2.435; 20 0.25,2.435; 21 -0.25,2.435; 22 -0.75,2.435; 23 -1.25,2.435; 24 -1.75,2.435 | smd 0.86 x 0.26: 9 2.435,-1.75; 10 2.435,-1.25; 11 2.435,-0.75; 12 2.435,-0.25; 13 2.435,0.25; 14 2.435,0.75; 15 2.435,1.25; 16 2.435,1.75; 25 -2.435,1.75; 26 -2.435,1.25; 27 -2.435,0.75; 28 -2.435,0.25; 29 -2.435,-0.25; 30 -2.435,-0.75; 31 -2.435,-1.25; 32 -2.435,-1.75 | smd 2.85 x 2.85: EP 0,0
R1S8-XXXX = smd 1.2 x 1.8: 1 -3.81,-5.1; 2 -1.27,-5.1; 3 1.27,-5.1; 4 3.81,-5.1; 5 3.81,5.1; 6 1.27,5.1; 7 -1.27,5.1; 8 -3.81,5.1
SOIC127P600X175-16N = smd 0.59 x 1.97: 1 -4.445,-2.475; 2 -3.175,-2.475; 3 -1.905,-2.475; 4 -0.635,-2.475; 5 0.635,-2.475; 6 1.905,-2.475; 7 3.175,-2.475; 8 4.445,-2.475; 9 4.445,2.475; 10 3.175,2.475; 11 1.905,2.475; 12 0.635,2.475; 13 -0.635,2.475; 14 -1.905,2.475; 15 -3.175,2.475; 16 -4.445,2.475
SOIC127P600X175-14N = smd 0.6 x 1.97: 1 -3.81,-2.475; 2 -2.54,-2.475; 3 -1.27,-2.475; 4 0,-2.475; 5 1.27,-2.475; 6 2.54,-2.475; 7 3.81,-2.475; 8 3.81,2.475; 9 2.54,2.475; 10 1.27,2.475; 11 0,2.475; 12 -1.27,2.475; 13 -2.54,2.475; 14 -3.81,2.475
P40-G240-WH = smd 0.35 x 0.9: 1 -1.775,-1.025; 3 1.775,-1.025; 4 1.775,1.025; 6 -1.775,1.025 | smd 2.6 x 1.45: 2 0,-1.025; 5 0,1.025
TBU-CA = smd 0.5 x 0.5: 1 -2.025,0; 2 0,0; 3 2.025,0
SHDRV4W50P254_4X1_1016X254H850P = drill 0.9 pad 1.4 square: 1 0,0 | drill 0.9 pad 1.4: 2 2.54,0; 3 5.08,0; 4 7.62,0
INDC2012X110N = smd 1.2 x 1.42: 1 -0.86,0; 2 0.86,0
WE-SL3_744252... = smd 1.27 x 1.78: 1 -3.5,2.6; 3 -3.5,-2.5; 4 3.6,-2.5; 6 3.6,2.6
MA5532-AE = smd 1.3 x 3.2: 1 -4.65,0; 2 4.65,0
0402 = smd 0.6 x 0.62: 1 -0.46,0; 2 0.46,0
INDC2016X180N = smd 1.14 x 1.82: 1 -0.89,0; 2 0.89,0
R0402 = smd 0.63 x 0.73: 1 -0.51,0; 2 0.51,0
R0603VISHTHICK = smd 0.72 x 0.99: 1 -0.69,0; 2 0.69,0
SOT95P229X117-3N = smd 0.59 x 1.22: 1 -0.95,-0.995; 2 0.95,-0.995; 3 0,0.995
416131160804 = smd 0.76 x 1.27: 1 -1.905,-3.81; 2 -0.635,-3.81; 3 0.635,-3.81; 4 1.905,-3.81; 5 1.905,3.81; 6 0.635,3.81; 7 -0.635,3.81; 8 -1.905,3.81
2030-XXT-SM = smd 1.6 x 5.6: 1 -3.3,0; 2 0,0; 3 3.3,0
691412120003 = drill 1.2: 1 -7,0; 2 -3.5,5; 3 0,0
TC2030-IDC-NL = smd 0.787 x 0.787: 1 1.27,-0.635; 2 1.27,0.635; 3 2.54,-0.635; 4 2.54,0.635; 5 3.81,-0.635; 6 3.81,0.635 | hole 1: 0,0; 5.08,1.016; 5.08,-1.016
XTAL1170X500X450N = smd 5.16 x 1.91: 1 -4.925,0; 2 4.925,0

### Placement (x,y rotation side)
C101  21.5,40 270 top
C103  12.5,34 180 top
C104  4,40 270 bottom
C105  10.5,38.2 270 bottom
C106  12.6,38.7 270 bottom
C107  15,38.7 270 bottom
C108  10.8,46 90 bottom
C109  5.5,46 270 bottom
C110  8,49 0 bottom
C207  15,73.5 0 top
C208  19.8,76 0 top
C209  19.8,74 0 top
C210  19.8,72 0 top
C211  19.8,67.15 0 top
C301  3.1,67.3 90 top
C302  6.6,63.8 0 top
C401  31,79.8 0 bottom
C501  52.9,76.75 90 top
C502  52.9,66.75 270 top
C503  34.9,59.8 180 top
C504  35.2,57 270 bottom
C601  50,60 90 top
C602  66.3,53.5 270 top
C603  66.3,53.5 270 bottom
C604  66.3,46 180 top
C605  66.2,39 180 top
C606  66.2,44 0 top
C607  63.2,39.8 270 top
D101  7.9,24.25 0 top
D102  16.5,30.5 180 top
D103  4,40 270 top
D110  18.5,11 270 bottom
D111  26,11 270 bottom
D112  64,11 270 bottom
D113  44,11 270 bottom
D501  15,29 0 bottom
D701  46,40.5 180 top
D702  57.5,40.5 0 top
D703  27.5,40.5 180 top
D704  39,40.5 0 top
F1  16.5,25.5 0 top
IC101  8,40 90 bottom
IC102  8,46 0 bottom
IC201  15,69.5 90 top
IC301  6.6,67.3 270 top
IC401  30.15,78.45 0 top
IC501  39,64.65 135 top
IC601  57.8,53.5 270 top
IC602  66.2,41.5 90 top
IC701  42.5,53.5 180 bottom
IC702  42.5,47.25 180 top
IC703  51.75,41.5 90 top
IC704  33.25,41.5 90 top
IC705  56.5,33.5 270 top
IC706  47.5,33.5 270 top
IC707  37.5,33.5 270 top
IC708  28.5,33.5 270 top
JP  66.28,61.86 90 top
L101  16.5,34 0 top
L102  21,34 0 top
L103  15.5,40 180 top
L104  15,43.07 270 bottom
L201  16,79 180 top
L501  34.9,62.85 180 top
L601  50,56 270 top
L602  66.3,48.8 0 top
R101  10.35,41.8 90 bottom
R110  18.5,6 270 bottom
R111  26,6 270 bottom
R112  64,6 270 bottom
R113  44,6 270 bottom
R202  19.8,70 180 top
R401  31.05,78.2 180 bottom
R501  52.9,71.75 90 top
R502  34.9,61.3 180 top
R503  15,25 0 bottom
R504  15,21.5 0 bottom
R505  34.9,58 0 top
R506  34.9,56.2 0 top
R701  35,49.5 180 bottom
R702  35,48 180 bottom
R703  32,49.5 0 bottom
R704  32,48 0 bottom
R705  35,51.2 0 bottom
R706  35,46.3 0 bottom
SW1  43,77.5 270 top
U$1  [PASSER]  68,80.5 0 top
U$2  [PASSER]  7,7.2 0 top
U$3  [PASSER]  65,24 0 top
V701  56.3,25 0 top
V702  36.4,25 0 top
X1  14.5,11 0 top
X2  40,11 0 top
X3  60,11 0 top
X10  27.5,70.5 270 top
Y500  57.15,71.75 90 top

### Tracks (layer width: path | path; a pad name or v marks a point on that pad's centre or on a via)
1WIREDQ  (via drill 0.3)
  Top 0.305: IC501.32 44.79,67 v45,67
  Bottom 0.305: v45,67 64.45,67 64.8,66.65 64.8,64.65 65.1,64.35 66.23,64.35 JP.2
+3V3  (via drill 0.3)
  Top 0.305: IC301.3 5.15,65.35 5.8,64.7 C302.1 v4.55,63.8 3.35,63.8 3.1,64.05 C301.1 3.8,66.5 4.6,67.3 IC301.2 | 15.97,72.33 IC201.5 IC201.6 | 15.97,72.33 15.8,72.5 C207.2 | v15.97,66.5 IC201.16 | 15.97,72.33 16.15,72.5 v16.7,72.5 | v45.2,79.4 v45.2,79.41 SW1.8 | v33.7,79.75 35.45,79.75 IC401.VE+ | v13,72.5 13,70.5 IC201.9 | R505.2 R506.2 v36.95,56.2 44.85,56.2 45.6,56.95 45.6,61.3 46.1,61.8 v46.1,70.45
  Bottom 0.305: IC102.5 8.95,48.85 C110.1 | v16.7,72.5 16.7,67.22 v15.97,66.5 | v33.7,79.75 33.65,79.8 C401.1 31.8,81 31.35,81.45 | IC701.1 37.17,55.98 v36.95,56.2 | v16.7,72.5 16.7,81 16.25,81.45 | v13,72.5 v16.7,72.5
  Bottom 0.61: C110.1 8.8,50.15 8.4,50.55 2.05,50.55 1.7,50.9 1.45,50.9 | 1.45,63.25 1.45,50.9 | 1.45,50.9 1.45,24.5 2.3,23.65 4.15,23.65 4.95,22.85 4.95,6.4 5.86,5.49 R110.2 R111.2 R113.2 R112.2 | v4.55,63.8 2,63.8 1.45,63.25 | 1.45,63.25 1.45,80.85 2.05,81.45 16.25,81.45 31.35,81.45 44.55,81.45 45.2,80.8 v45.2,79.4 v45.2,79.41 45.75,79.41 46.1,79.06 v46.1,70.45
+5V  (via drill 0.3)
  Top 0.305: v16.3,45.2 22.05,45.2 22.5,45.65 22.5,53.95 23.1,54.55 47.75,54.55 48.3,55.1 48.3,58.6 48.8,59.1 C601.1 L601.1
  Bottom 0.305: L104.1 15,44.9 | 15,44.9 14.7,45.2 C108.1 9.4,45.2 IC102.1 8.95,43.95 8.7,43.7 7.3,43.7 7.05,43.95 IC102.3 | 15,44.9 15.3,45.2 v16.3,45.2
ADIN24  (via drill 0.3)
  Top 0.254: IC501.24 38,61.17 v38,57.85 | v20,57.9 v23.4,57.9
  Bottom 0.254: v38,57.85 35.25,57.85 C504.1 35.1,57.9 v23.4,57.9 | R503.3 16.39,26 16.76,26.36 D501.C 19.6,29 20,29.4 v20,57.9
ATVCC  (via drill 0.3)
  Top 0.254: IC501.6 40.69,67.4 41,67.4 41.17,67.22 | 41.17,67.22 41.45,66.95 41.45,66.75 IC501.4 | v41.65,67.7 41.17,67.22 | IC501.20 36.25,62.25 34.7,62.25 34.44,62.51 L501.2
  Top 0.305: SW1.2 40.27,78.14 40.75,77.65 40.75,69.9 v40.1,69.25 | v34.45,63.85 L501.2
  Top 0.406: SW1.2 SW1.1
  Bottom 0.254: v41.65,67.7 v40.1,69.25
  Bottom 0.305: v34.45,63.85 34.7,63.85 v40.1,69.25
BAUDTX
  Top 0.254: IC501.12 35,69 35,74.4 35.45,74.85 40,74.85 40.25,75.1 40.25,76.6 39.98,76.86 SW1.3
DE  (via drill 0.3)
  Top 0.254: v41.85,57.85 41.85,60.03 IC501.26
  Bottom 0.254: v41.85,57.85 41.85,55.99 IC701.4
FORMAT
  Top 0.254: IC501.14 33.75,68.84 33.75,73.85 35.49,75.59 SW1.4
GND  (via drill 0.3)
  Top 0.254: IC501.EP 39,65 IC501.5 | IC501.3 40.06,64.65 IC501.EP | IC501.21 39,64.3 IC501.EP | IC201.7 14.68,69.83 | 14.68,69.83 IC201.EP 14.03,68.53 IC201.12 | 14.68,69.83 15.35,70.5 16.9,70.5
  Top 0.305: IC201.15 15.32,69.17 IC201.EP
  Bottom 0.254: IC101.4 7.75,40.25 IC101.13
  other vias: 1.02,81.97 29.22,66.87 38.95,69.15 32.75,70.75 32.65,66.1 31.05,64.6 17.45,66.5 11.4,71.3 32.9,69.1 31.3,68.6 36.85,61.95 58.85,54.85 69.8,81.9 2.62,80.37 1.22,23.27 2.62,24.97 4.72,1.17 22.32,1.27 22.62,8.77 17.02,41.57 23.42,55.67 23.15,65.9 17.65,80.1 15.55,80.1 69.55,54.65 44.85,64.35 44.05,80.15
  pour Top: 0,83 71,83 71,54 23,54 23,0 0,0
  pour Bottom: 0,83 71,83 71,54 23,54 23,0 0,0
HUMIN
  Top 0.254: IC501.23 37.42,61.3 R502.1 35.41,60.84 35.7,60.55 C503.1
HUMOUT  (via drill 0.3)
  Top 0.254: R502.2 34.39,61.81 32.6,63.6 24.6,63.6 24.05,64.15 24.05,73.55 24.5,74 32.75,74 33.7,74.95 v33.7,78.45 IC401.OUT
  Bottom 0.254: R401.2 33.45,78.2 v33.7,78.45
IRQ  (via drill 0.3)
  Top 0.254: IC201.10 12.99,69.8 11.55,69.8 11.15,69.4 11.15,67.35 14,64.5 21.55,64.5 25.05,61 v30.2,61 | IC501.1 42.85,66.03 v42.85,66.05
  Bottom 0.305: v30.2,61 31.4,61 33.4,59 42.75,59 42.9,58.85 43.4,58.85 43.8,59.25 43.8,65.1 v42.85,66.05
ISP5V  (via drill 0.3)
  Top 0.305: X10.2 30.63,69.23 v31.2,69.8 | v45.2,78.1 46.77,78.1 SW1.7
  Bottom 0.305: v31.2,69.8 39.8,69.8 39.9,69.9 44.9,69.9 45.2,70.2 v45.2,78.1
LEDERROR  (via drill 0.3)
  Top 0.254: IC501.13 34.4,68.9 v34.4,70.8 | v22.4,17.6 v22.4,12.8
  Bottom 0.254: v34.4,70.8 33.35,71.85 23.1,71.85 22.4,71.15 v22.4,17.6 | D111.1 22.5,12.7 v22.4,12.8
LEDON  (via drill 0.3)
  Top 0.254: IC501.11 35.8,68.91 v35.8,70.8 | v16.9,17.6 v16.9,12.8
  Bottom 0.254: v35.8,70.8 34.3,72.3 22.9,72.3 21.95,71.35 21.95,18.25 21.3,17.6 v16.9,17.6 | v16.9,12.8 17,12.7 D110.1
LEDRX  (via drill 0.3)
  Top 0.254: IC501.10 36.8,68.62 v36.8,70.8 | v42.4,12.8 41.9,12.3 41.9,8 41.4,7.5 22.2,7.5 21.7,8 21.7,17.7 v20.8,18.6
  Bottom 0.254: v36.8,70.8 34.85,72.75 22.75,72.75 21.5,71.5 21.5,19.3 v20.8,18.6 | D113.1 43.9,12.8 v42.4,12.8
LEDTX  (via drill 0.3)
  Top 0.254: IC501.9 37.8,68.33 v37.8,70.8 | v19.7,18.6 19.9,18.6 21.2,17.3 21.2,7.8 22,7 61.5,7 61.9,7.4 61.9,12.3 v62.4,12.8
  Bottom 0.254: v37.8,70.8 35.4,73.2 22.55,73.2 21.05,71.7 21.05,19.95 v19.7,18.6 | D112.1 63.9,12.8 v62.4,12.8
LTC3245_VOUT
  Bottom 0.305: IC101.7 9.33,42.03 9.61,42.31 R101.2 10.89,42.31 11.1,42.1 11.1,40.2 10.65,39.75 | IC101.10 10.65,39.75 | 10.65,39.75 12.45,39.75 C106.1 13.2,40.2 C107.1 L104.2
LTC3245C+  (via drill 0.3)
  Top 0.305: v9.5,37.3 9.5,39.6 v10.3,40.4
  Bottom 0.305: C105.2 9.8,37.6 v9.5,37.3 | IC101.9 10.15,40.25 v10.3,40.4
LTC3245C-
  Bottom 0.305: IC101.11 10.05,39.25 C105.1
LTC3245VIN  (via drill 0.4)
  Top 0.406: v6.67,42.5 v6.67,37.5
  Top 0.61: L103.6 11.9,35.7 11.7,35.5 C103.2 10.4,34 9.9,34.5 9.9,35.5 9.3,36.1 4.5,36.1 | 4.5,36.1 4,36.6 D103.2 C104.2 | v3.1,36.08 3.12,36.1 4.5,36.1
  Bottom 0.305: IC101.1 IC101.2 IC101.3 | v6.67,37.5 IC101.1 | IC101.6 v6.67,42.5 | C104.2 5.62,38.33 6.05,38.75 IC101.1
  Bottom 0.61: C104.2 4,36.98 v3.1,36.08
MISO  (via drill 0.3)
  Top 0.254: v25.2,69.2 25.23,69.23 X10.1 | IC501.16 33.83,67.35 v33.6,67.35
  Bottom 0.254: v33.6,67.35 31.75,69.2 v25.2,69.2
MOSI
  Top 0.254: IC501.15 33.92,67.96 X10.4
N$2
  Top 0.813: F1.2 16.9,25.5 16,26.4 16,27.8 14.37,29.43 D102.A
N$3
  Top 0.61: L103.3 20.9,42.5 21.5,41.9 C101.1 18.7,40.8 17.36,39.46 L101.2
N$4
  Top 0.61: L103.1 19,38.6 19.6,39.2 C101.2 21.5,36.9 21.86,36.54 L102.2
N$5
  Top 0.61: L102.1 20.14,32.84 18.64,31.34 D102.C
N$6
  Top 1.016: X3.1 V701.1 48.8,25 47.5,26.3 IC706.3
N$7
  Top 0.305: IC201.1 18.57,68.53 18.9,68.2 C211.1
N$8
  Top 0.305: L201.2 18.5,79 19,78.5 C208.1 C209.1 C210.1 19,70.11 R202.2 18.1,70 17.93,69.83 IC201.3
N$9
  Top 0.305: L201.1 20.65,76.05 C208.2 C209.2 C210.2 20.6,70.11 R202.1 20.49,69.49 20.18,69.17 IC201.2
N$10
  Bottom 0.254: 9.76,40.75 9.81,40.75 R101.1
  Bottom 0.305: IC101.8 9.76,40.75
N$11
  Top 0.254: IC501.7 43.82,71.24 R501.1
  Top 0.305: R501.1 C502.1 56.33,67.65 Y500.1
N$12
  Top 0.254: IC501.8 44.13,72.26 R501.2
  Top 0.305: R501.2 C501.1 56.33,75.85 Y500.2
N$13
  Top 0.254: IC501.18 35.44,62.85 L501.1
N$14
  Bottom 0.254: D110.2 R110.1
N$15
  Bottom 0.254: R111.1 D111.2
N$16
  Bottom 0.254: D112.2 R112.1
N$17
  Bottom 0.254: D113.2 R113.1
N$18
  Top 0.305: IC602.4 64.94,43.84 65.1,44 C606.1
N$19
  Top 0.305: C605.1 67,40.09 IC602.1 68.45,40.55 68.7,40.8 68.7,42.1 68.35,42.45 IC602.3 67.45,42.95 67.8,43.3 67.8,44.4 67.2,45 C604.1 L602.2
N$20
  Top 1.016: X2.1 33,24.9 V702.1 30,25 28.5,26.5 IC708.3
N$21
  Top 0.305: IC702.12 43.77,43.13 44,42.9 48.5,42.9 49.4,43.8 52.25,43.8 IC703.3
N$22
  Top 0.305: IC601.5 62.9,50.7 63.1,50.9 65.75,50.9 C602.2 65.41,50.55 L602.1
N$23
  Top 0.305: L601.2 51.19,55.11 51.53,54.77 IC601.2 52.7,55.6 53,55.9 65.95,55.9 C602.1
N$24
  Top 1.016: X2.3 39.7,11.3 V702.3 39.7,29.27 IC707.3
N$25
  Top 0.305: IC704.1 36.19,39.73 D704.1
  Top 0.813: IC707.1 36.96,36.06 D704.1
N$26
  Top 0.406: IC704.6 30.32,39.73 D703.1
  Top 0.813: IC708.1 29.54,36.56 D703.1
N$27  (via drill 0.3)
  Top 0.305: v32.7,46.85 33.4,47.55 41.7,47.55 42.5,48.35 IC702.4
  Bottom 0.305: R706.2 R702.1 R704.1 v32.69,46.86 v32.7,46.85
N$28
  Top 1.016: X3.3 59.6,11.4 V701.3 59.6,28.38 IC705.3
N$29
  Top 0.305: IC703.1 54.69,39.73 D702.1
  Top 0.813: IC705.1 55.46,36.56 D702.1
N$30
  Top 0.305: IC703.6 48.81,39.73 D701.1
  Top 0.813: IC706.1 48.04,36.06 D701.1
N$31  (via drill 0.3)
  Top 0.305: IC702.5 41.23,48.22 v41.25,48.2
  Bottom 0.305: IC701.15 39.33,49.83 39.65,49.5 40.85,49.5 41.25,49.1 v41.25,48.2
N$32
  Top 0.305: IC702.9 39.96,43.16 39.7,42.9 36.6,42.9 35.7,43.8 32.75,43.8 IC704.4
N$33  (via drill 0.3)
  Top 0.305: IC702.2 v45.04,48.21 v45.05,48.2
  Bottom 0.305: IC701.11 44.41,48.84 v45.05,48.2
N$34
  Top 0.305: IC702.11 42.5,42.7 42.8,42.4 48.7,42.4 49.58,43.27 IC703.4
N$35
  Top 0.305: IC702.10 41.23,42.73 40.9,42.4 36.4,42.4 35.52,43.27 IC704.3
N$36  (via drill 0.3)
  Top 0.305: IC702.3 43.77,51.23 43.5,51.5 33.55,51.5 v32.7,50.65
  Bottom 0.305: R705.2 R701.1 R703.1 v32.7,50.65
N$37
  Bottom 0.305: R702.2 40.5,48 40.95,47.55 41.5,47.55 41.9,47.95 41.9,51.01 IC701.13
N$38
  Bottom 0.305: IC701.14 40.59,52.2 40.45,52.35 38.85,52.35 38.7,52.2 38.7,49.8 38.4,49.5 R701.2
N$40
  Bottom 0.305: C109.1 5.5,47 5.75,47.26 IC102.4
N$42
  Bottom 0.254: R504.1 15.69,22.49 15.95,22.75 R503.1
PE  (via drill 0.7)
  Top 0.813: D704.2 D701.2 | L101.1 15.64,32.89 15.15,32.4 12.6,32.4 12.1,31.9 12.1,28.9 9.4,26.2 7.1,26.2 6.22,25.32 D101.1 6.22,17.58 7.8,16 X1.2
  Top 1.016: V702.2 v36.4,21 | V701.2 v56.3,21 | D701.2 42.5,40.5 v42.5,38.9 | D703.2 25.46,42.74 v25.4,42.8 | D702.2 59.54,42.76 v59.5,42.8
  Bottom 1.016: X1.1 7.5,14.8 8.7,16 X1.2 24.6,16 29.6,21 v36.4,21 41.3,21 | 41.3,21 v56.3,21 | v25.4,42.8 29.3,38.9 v42.5,38.9 | v59.5,42.8 55.6,38.9 v42.5,38.9 | v42.5,38.9 42.5,22.2 41.3,21
RE  (via drill 0.3)
  Top 0.254: v40.6,57.85 40.6,60.58 IC501.25
  Bottom 0.254: v40.6,57.85 IC701.3
RELAY  (via drill 0.3)
  Top 0.254: IC501.2 42.25,66.13 42.25,66.35 43.9,68 v45,68
  Bottom 0.254: v45,68 64.81,68 JP.4
RESET  (via drill 0.3)
  Top 0.254: X10.5 v25.15,66.7 | IC501.29 41.75,62.25 v42,62.25
  Bottom 0.254: v25.15,66.7 24.5,66.05 24.5,64.45 25.05,63.9 30.6,63.9 32,62.5 32.5,62.5 32.65,62.65 34.85,62.65 37.85,65.65 38.6,65.65 v42,62.25
RS485_GND  (via drill 0.3)
  other vias: 69.7,23.2 32.4,51.8 24.6,52.5 24.6,1.3 66.1,1.2 24.7,18.5 69.6,52.4 24.6,14.7 28,8.5 50,27.1 45.2,27.1 30.8,27.1 63.8,47.5 55.1,43.8 30.3,43.1
  pour Top: 24,53 24,0 71,0 71,53
  pour Bottom: 24,53 24,0 71,0 71,53
RX  (via drill 0.3)
  Top 0.254: v44.4,57.85 44.4,61.1 42.6,62.9 41.81,62.9 IC501.30
  Bottom 0.254: v44.4,57.85 IC701.6
SCK
  Top 0.254: X10.3 24.91,67.96 24.5,67.55 24.5,64.45 24.85,64.1 29.65,64.1 29.9,64.35 29.9,67.05 30.3,67.45 32.65,67.45 33.35,66.75 33.46,66.75 IC501.17
SCL  (via drill 0.3)
  Top 0.254: v9.05,67.3 IC301.5 | v43.15,59.5 43.15,60.25 42.6,60.8 42.5,60.8 IC501.28
  Top 0.305: IC201.11 11.82,69.17 v11.8,69.15 11.8,67.4 14.2,65 21.75,65 24.7,62.05 v30.2,62.05 31.05,62.05 31.4,61.7 31.4,56.9 32.1,56.2 R506.1
  Bottom 0.254: v11.8,69.15 9.25,69.15 9.05,68.95 v9.05,67.3
  Bottom 0.305: v30.2,62.05 31.1,62.05 33.65,59.5 v43.15,59.5
SDA  (via drill 0.3)
  Top 0.254: IC501.27 42.45,60.14 | v10.05,67.3 10.05,68.55 9.8,68.8 IC301.6
  Top 0.305: IC201.13 14.03,66.53 v14,66.5 14,65.9 14.4,65.5 21.95,65.5 24.45,63 v30.2,63 31.25,63 31.95,62.3 31.95,58.5 32.45,58 R505.1 | 42.45,60.14 v42.45,60.12
  Bottom 0.254: v10.05,67.3 13.2,67.3 v14,66.5
  Bottom 0.305: v30.2,63 30.85,63 33.75,60.1 42.43,60.1 v42.45,60.12
TX  (via drill 0.3)
  Top 0.254: v39.35,57.85 39.35,57.05 39.6,56.8 44.7,56.8 45,57.1 45,61.15 42.75,63.4 42.02,63.4 IC501.31
  Bottom 0.254: v39.35,57.85 39.35,56 IC701.2
VDD  (via drill 0.3)
  Top 0.305: IC602.5 64.89,40.6 C607.1 63.2,44.3 62.73,44.77 47.9,44.77 | 47.9,44.77 IC702.14 IC702.13 | v47.7,45.6 47.7,44.98 47.9,44.77
  Bottom 0.305: v47.7,45.6 47.7,45.17 47.3,44.77 31.62,44.77 31.3,45.1 R704.2 R703.2 31.31,52.01 32,52.7 37.8,52.7 38.05,52.45 IC701.16
VIN
  Top 0.813: X1.3 14.5,16.8 13.4,17.9 10.5,17.9 9.58,18.82 D101.2 10.83,25.5 F1.1
  Bottom 0.254: R504.2 6.1,21.5 5.7,21.1 5.7,9.2 6.2,8.7 13.9,8.7 14.5,9.3 X1.3

### Text on the board
Top: TOP
Bottom: BOT
tPlace: 3.3V | ISP | BAUD | FORM | R | 1W | WireGate | TOP | EPN 01003760269 | ON | ERROR | ACT | ACT | GND | GND | 24V+ | A | C | B | B | C | A | PWR | OUT | IN
bPlace: BOT